# EAGLE board EEZ DIB MCU r2B4 (EAGLE 7.2.0), part 1 of 2
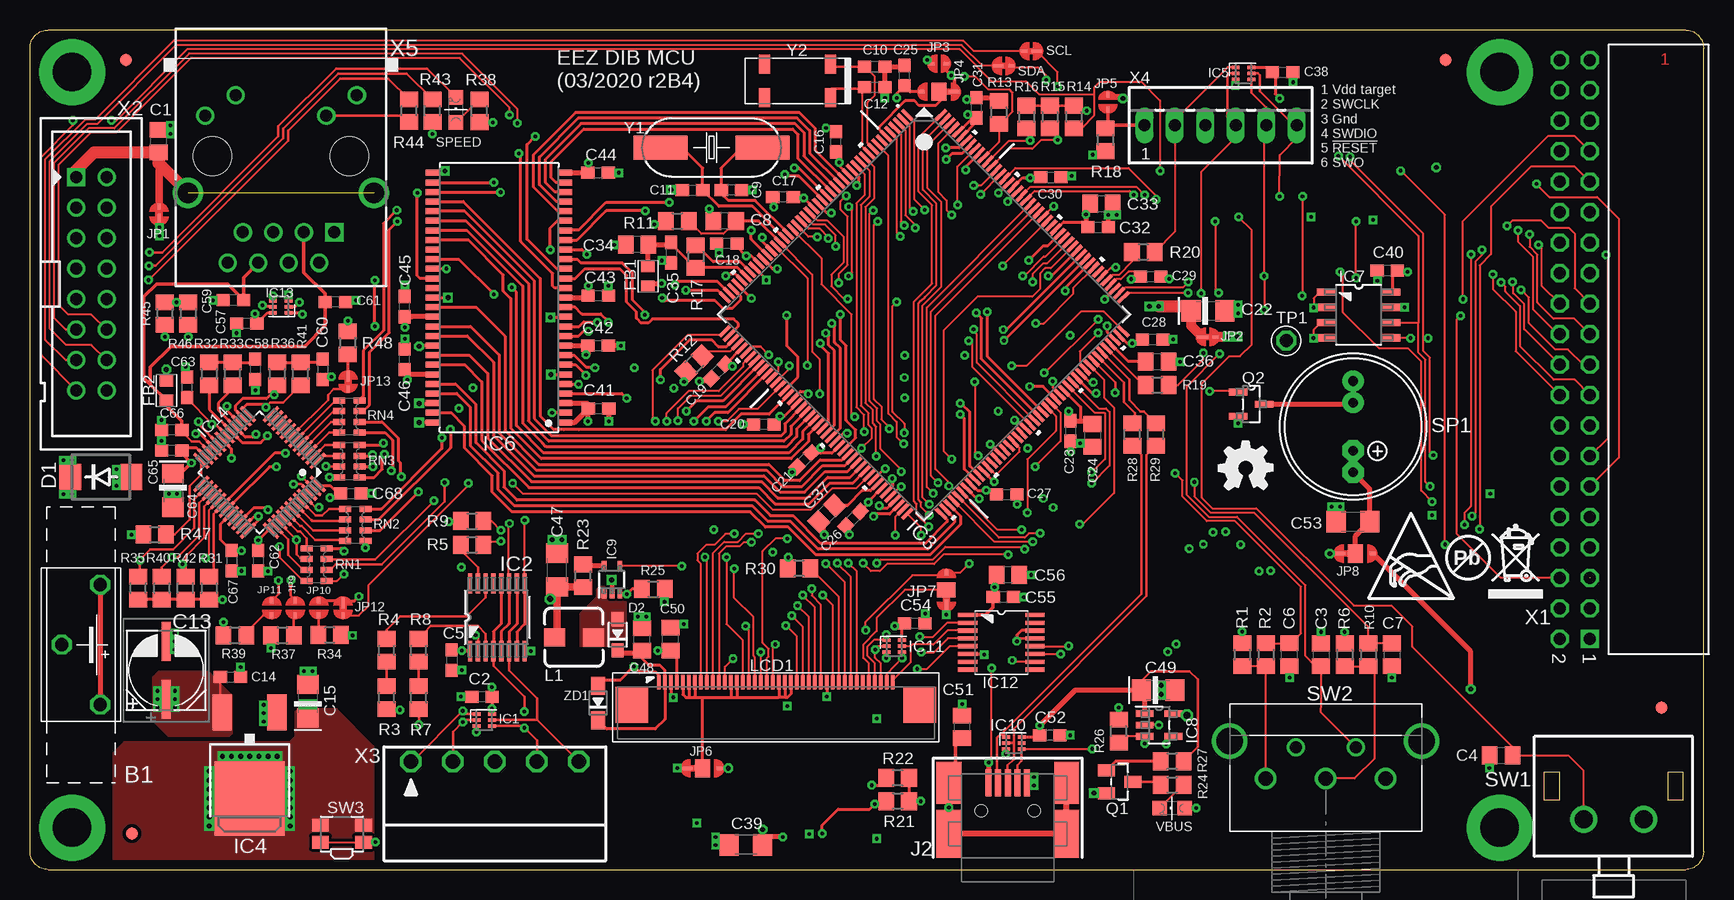
[diagram p5: board, top side]
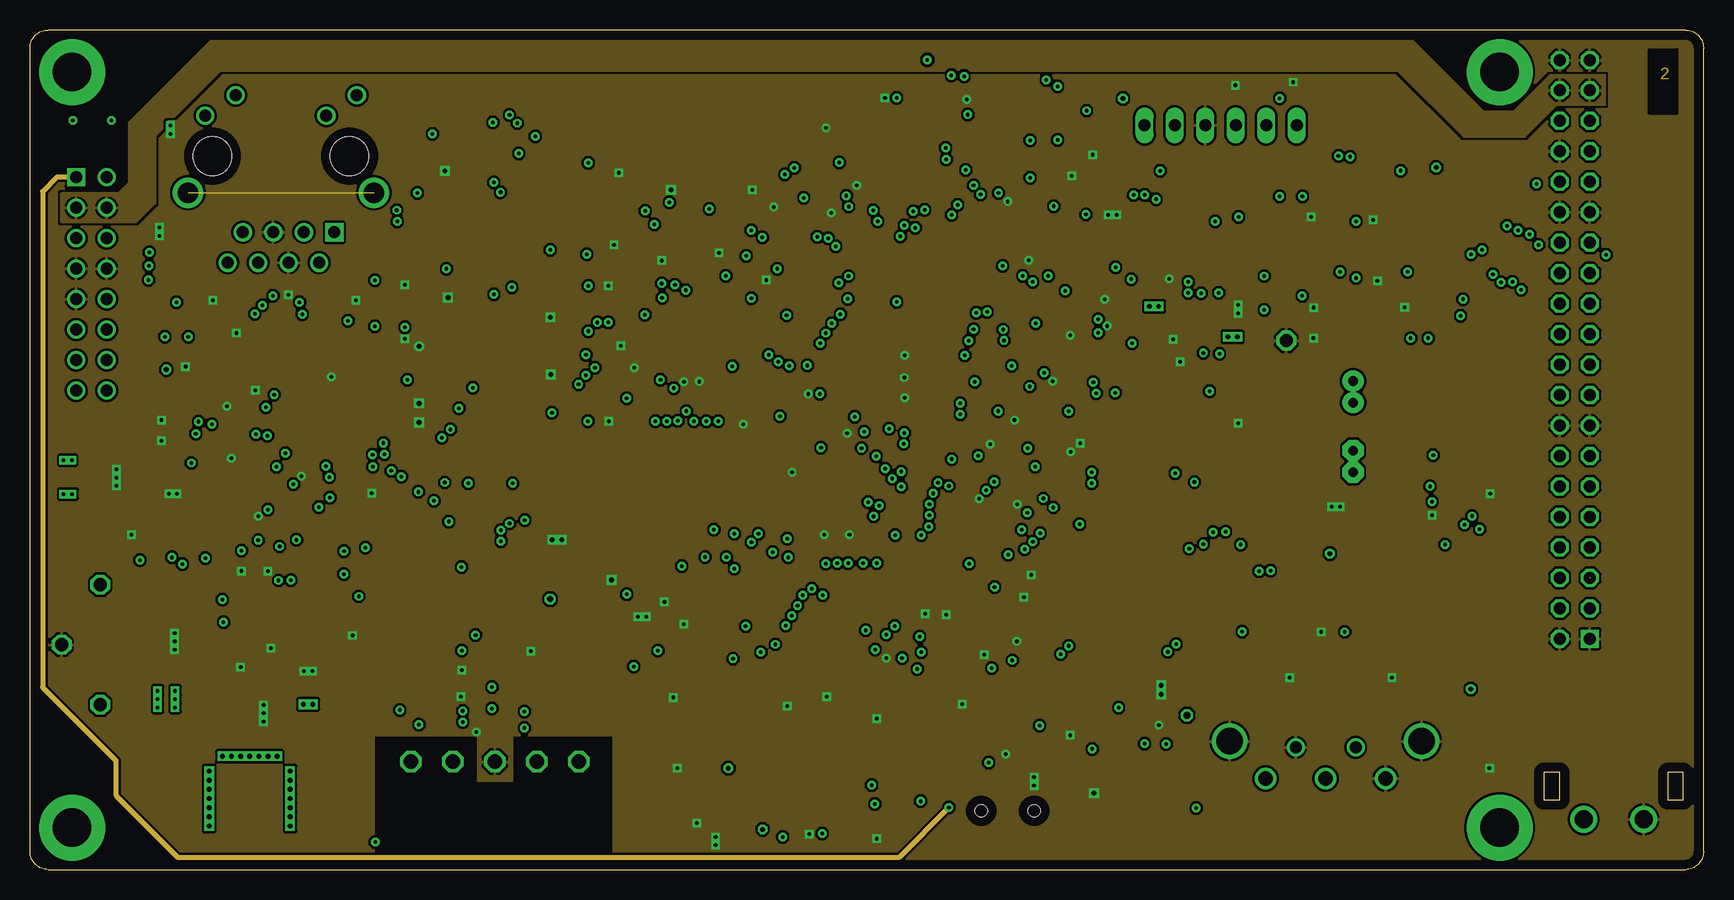
[diagram p6: board, inner layer Gnd]
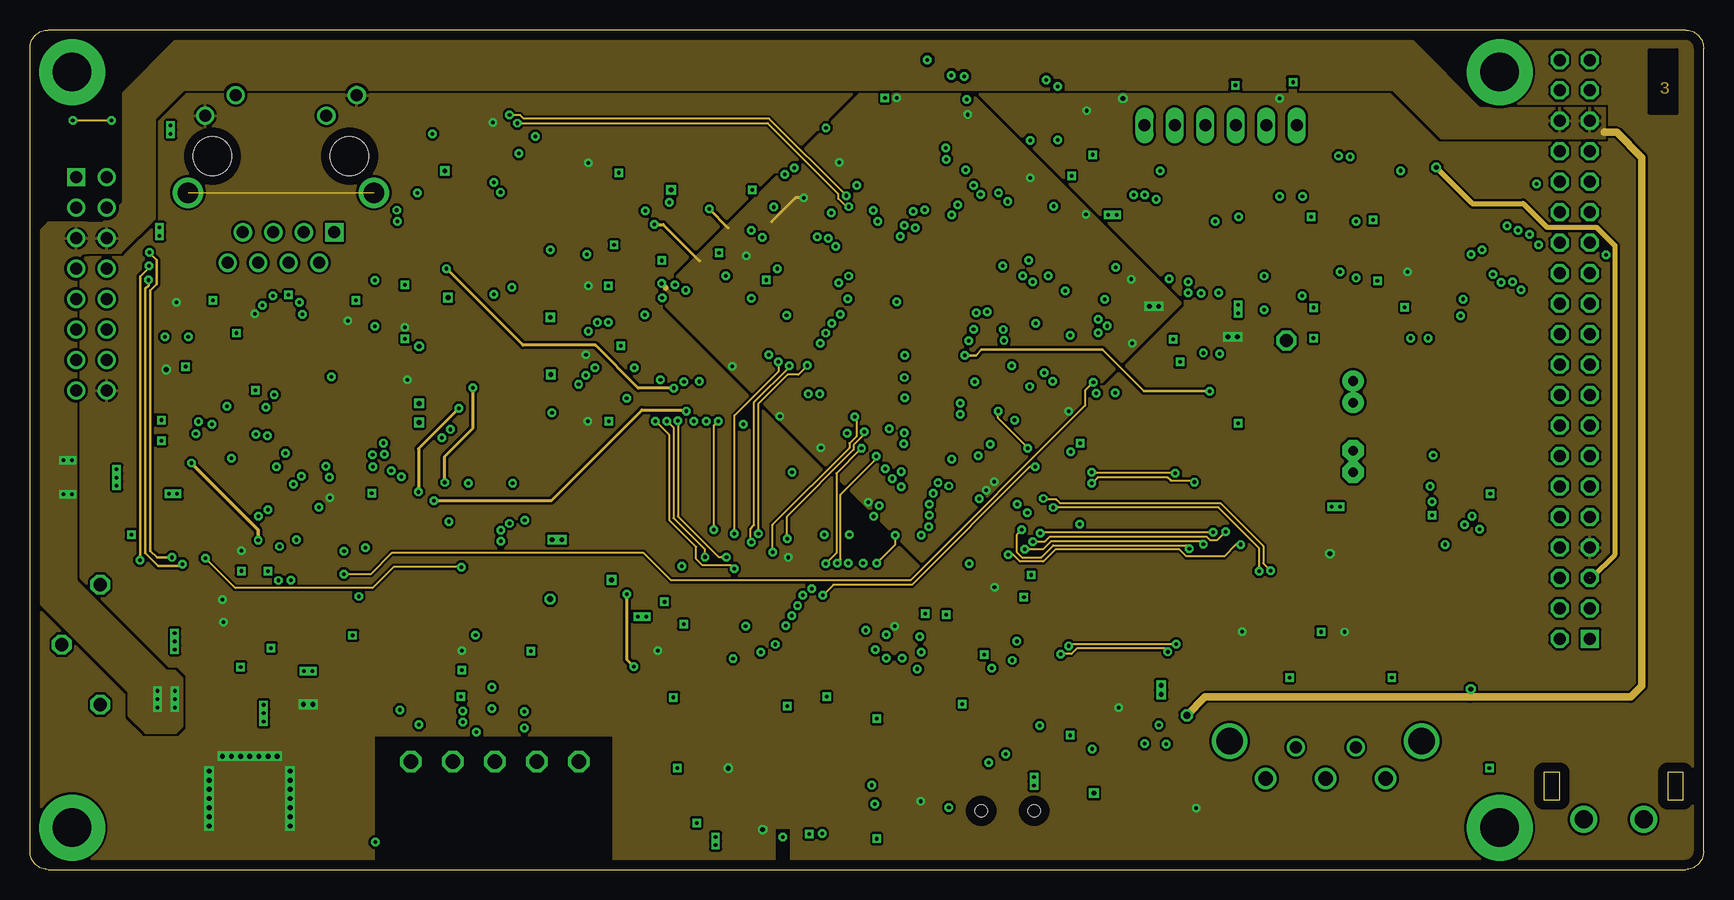
[diagram p7: board, inner layer Power]
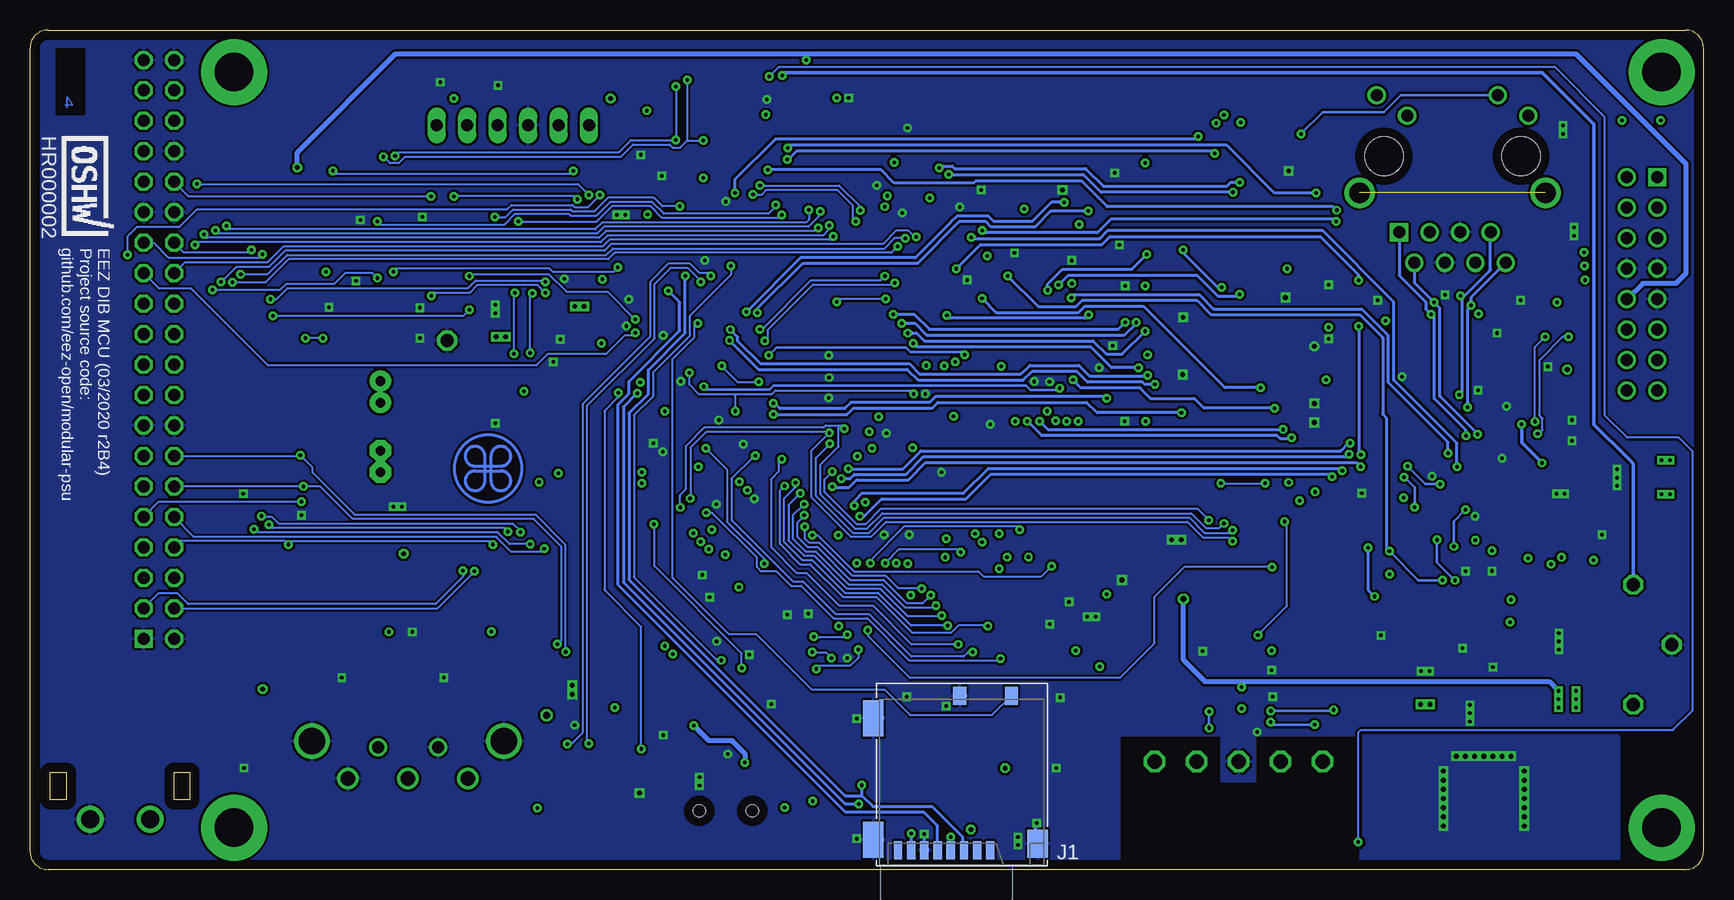
[diagram p8: board, bottom side, seen from below]

Size 139.5 x 70 mm. Coordinates in mm from the lower left corner, seen from the top.
Outline: 1.5,0 138,0 arc90 139.5,1.5 139.5,68.5 arc90 138,70 1.5,70 arc90 0,68.5 0,1.5 arc90 1.5,0
Copper layers (1+2+15+16): Top 0.035559375mm / dielectric 7mil / Gnd 0.03048125mm / dielectric 44mil / Power 0.03048125mm / dielectric 7mil / Bottom 0.035559375mm
Design rules "DIB 4-layer": minimum track width 6mil, minimum drill 0.3mm, track to track 4mil, track to pad 4mil, pad to pad 4mil, via to via 4mil, smd to smd 4mil, copper to edge 30mil, drill to drill 8mil, minimum pad ring 4mil, minimum via ring 8mil, stop-mask expansion 2.5mil, vias tented up to drill 0.6mm, thermal gap 8mil
Net classes: 0 default: width 0.152 mm, drill 0.3 mm, clearance 0.203 mm; 1 diff: width 0.229 mm, drill 0.3 mm, clearance 0.203 mm; 2 gnd: width 0.152 mm, drill 0.3 mm, clearance 0.203 mm

## Footprints (pad centres in the part's own frame; a part is rotated, then mirrored left to right if it is on the bottom)
S8401-46 = drill 1.1 octagon: 1 -5,-1.6; 2 0,1.6; 3 5,-1.6
C0805 = smd 1.3 x 1.5: 1 -0.95,0; 2 0.95,0
C0603 = smd 1.1 x 1: 1 -0.85,0; 2 0.85,0
CAPAE660X610N = smd 3.251 x 0.762: 1 -2.413,0; 2 2.413,0
EC1206 = smd 1.6 x 1.8: + -1.4,0; - 1.4,0
C1206 = smd 1.6 x 1.8: 1 -1.4,0; 2 1.4,0
DO214AA = smd 1.8 x 2.2: A 2.55,0; C -2.55,0
SOD323-R = smd 1.2 x 1: A 1.3,0; C -1.3,0
BEAD0603 = smd 1 x 1.1: P$1 -0.85,0; P$2 0.85,0
FIDUCIAL = smd 1.016 x 1.016: T 0,0
DRL6 = smd 0.654 x 0.301: 1 -0.65,0.5; 2 -0.65,0; 3 -0.65,-0.5; 4 0.65,-0.5; 5 0.65,0; 6 0.65,0.5
PW16 = smd 1.676 x 0.356: 1 -2.819,2.275; 2 -2.819,1.625; 3 -2.819,0.975; 4 -2.819,0.325; 5 -2.819,-0.325; 6 -2.819,-0.975; 7 -2.819,-1.625; 8 -2.819,-2.275; 9 2.819,-2.275; 10 2.819,-1.625; 11 2.819,-0.975; 12 2.819,-0.325; 13 2.819,0.325; 14 2.819,0.975; 15 2.819,1.625; 16 2.819,2.275
LQFP-176_24X24MM = smd 1.2 x 0.3: 1 -12.75,10.75; 2 -12.75,10.25; 3 -12.75,9.75; 4 -12.75,9.25; 5 -12.75,8.75; 6 -12.75,8.25; 7 -12.75,7.75; 8 -12.75,7.25; 9 -12.75,6.75; 10 -12.75,6.25; 11 -12.75,5.75; 12 -12.75,5.25; 13 -12.75,4.75; 14 -12.75,4.25; 15 -12.75,3.75; 16 -12.75,3.25; 17 -12.75,2.75; 18 -12.75,2.25; 19 -12.75,1.75; 20 -12.75,1.25; 21 -12.75,0.75; 22 -12.75,0.25; 23 -12.75,-0.25; 24 -12.75,-0.75; 25 -12.75,-1.25; 26 -12.75,-1.75; 27 -12.75,-2.25; 28 -12.75,-2.75; 29 -12.75,-3.25; 30 -12.75,-3.75; 31 -12.75,-4.25; 32 -12.75,-4.75; 33 -12.75,-5.25; 34 -12.75,-5.75; 35 -12.75,-6.25; 36 -12.75,-6.75; 37 -12.75,-7.25; 38 -12.75,-7.75; 39 -12.75,-8.25; 40 -12.75,-8.75; 41 -12.75,-9.25; 42 -12.75,-9.75; 43 -12.75,-10.25; 44 -12.75,-10.75; 89 12.75,-10.75; 90 12.75,-10.25; 91 12.75,-9.75; 92 12.75,-9.25; 93 12.75,-8.75; 94 12.75,-8.25; 95 12.75,-7.75; 96 12.75,-7.25; 97 12.75,-6.75; 98 12.75,-6.25; 99 12.75,-5.75; 100 12.75,-5.25; 101 12.75,-4.75; 102 12.75,-4.25; 103 12.75,-3.75; 104 12.75,-3.25; 105 12.75,-2.75; 106 12.75,-2.25; 107 12.75,-1.75; 108 12.75,-1.25; 109 12.75,-0.75; 110 12.75,-0.25; 111 12.75,0.25; 112 12.75,0.75; 113 12.75,1.25; 114 12.75,1.75; 115 12.75,2.25; 116 12.75,2.75; 117 12.75,3.25; 118 12.75,3.75; 119 12.75,4.25; 120 12.75,4.75; 121 12.75,5.25; 122 12.75,5.75; 123 12.75,6.25; 124 12.75,6.75; 125 12.75,7.25; 126 12.75,7.75; 127 12.75,8.25; 128 12.75,8.75; 129 12.75,9.25; 130 12.75,9.75; 131 12.75,10.25; 132 12.75,10.75 | smd 0.3 x 1.2: 45 -10.75,-12.75; 46 -10.25,-12.75; 47 -9.75,-12.75; 48 -9.25,-12.75; 49 -8.75,-12.75; 50 -8.25,-12.75; 51 -7.75,-12.75; 52 -7.25,-12.75; 53 -6.75,-12.75; 54 -6.25,-12.75; 55 -5.75,-12.75; 56 -5.25,-12.75; 57 -4.75,-12.75; 58 -4.25,-12.75; 59 -3.75,-12.75; 60 -3.25,-12.75; 61 -2.75,-12.75; 62 -2.25,-12.75; 63 -1.75,-12.75; 64 -1.25,-12.75; 65 -0.75,-12.75; 66 -0.25,-12.75; 67 0.25,-12.75; 68 0.75,-12.75; 69 1.25,-12.75; 70 1.75,-12.75; 71 2.25,-12.75; 72 2.75,-12.75; 73 3.25,-12.75; 74 3.75,-12.75; 75 4.25,-12.75; 76 4.75,-12.75; 77 5.25,-12.75; 78 5.75,-12.75; 79 6.25,-12.75; 80 6.75,-12.75; 81 7.25,-12.75; 82 7.75,-12.75; 83 8.25,-12.75; 84 8.75,-12.75; 85 9.25,-12.75; 86 9.75,-12.75; 87 10.25,-12.75; 88 10.75,-12.75; 133 10.75,12.75; 134 10.25,12.75; 135 9.75,12.75; 136 9.25,12.75; 137 8.75,12.75; 138 8.25,12.75; 139 7.75,12.75; 140 7.25,12.75; 141 6.75,12.75; 142 6.25,12.75; 143 5.75,12.75; 144 5.25,12.75; 145 4.75,12.75; 146 4.25,12.75; 147 3.75,12.75; 148 3.25,12.75; 149 2.75,12.75; 150 2.25,12.75; 151 1.75,12.75; 152 1.25,12.75; 153 0.75,12.75; 154 0.25,12.75; 155 -0.25,12.75; 156 -0.75,12.75; 157 -1.25,12.75; 158 -1.75,12.75; 159 -2.25,12.75; 160 -2.75,12.75; 161 -3.25,12.75; 162 -3.75,12.75; 163 -4.25,12.75; 164 -4.75,12.75; 165 -5.25,12.75; 166 -5.75,12.75; 167 -6.25,12.75; 168 -6.75,12.75; 169 -7.25,12.75; 170 -7.75,12.75; 171 -8.25,12.75; 172 -8.75,12.75; 173 -9.25,12.75; 174 -9.75,12.75; 175 -10.25,12.75; 176 -10.75,12.75
DPACK = smd 1.6 x 3: 1 -2.28,-4.8; 3 2.28,-4.8 | smd 5.8 x 6.2: 4 0,2.38
TSOPII-54 = smd 1.2 x 0.5: 1 -5.502,10.4; 2 -5.502,9.6; 3 -5.502,8.8; 4 -5.502,8; 5 -5.502,7.2; 6 -5.502,6.4; 7 -5.502,5.6; 8 -5.502,4.8; 9 -5.502,4; 10 -5.502,3.2; 11 -5.502,2.4; 12 -5.502,1.6; 13 -5.502,0.8; 14 -5.502,0; 15 -5.502,-0.8; 16 -5.502,-1.6; 17 -5.502,-2.4; 18 -5.502,-3.2; 19 -5.502,-4; 20 -5.502,-4.8; 21 -5.502,-5.6; 22 -5.502,-6.4; 23 -5.502,-7.2; 24 -5.502,-8; 25 -5.502,-8.8; 26 -5.502,-9.6; 27 -5.502,-10.4; 28 5.502,-10.4; 29 5.502,-9.6; 30 5.502,-8.8; 31 5.502,-8; 32 5.502,-7.2; 33 5.502,-6.4; 34 5.502,-5.6; 35 5.502,-4.8; 36 5.502,-4; 37 5.502,-3.2; 38 5.502,-2.4; 39 5.502,-1.6; 40 5.502,-0.8; 41 5.502,0; 42 5.502,0.8; 43 5.502,1.6; 44 5.502,2.4; 45 5.502,3.2; 46 5.502,4; 47 5.502,4.8; 48 5.502,5.6; 49 5.502,6.4; 50 5.502,7.2; 51 5.502,8; 52 5.502,8.8; 53 5.502,9.6; 54 5.502,10.4
SOIC127P600X173-8N = smd 1.55 x 0.6: 1 -2.7,1.9; 2 -2.7,0.63; 3 -2.7,-0.64; 4 -2.7,-1.91; 5 2.7,-1.91; 6 2.7,-0.64; 7 2.7,0.63; 8 2.7,1.9
DBV5 = smd 1.473 x 0.559: 1 -1.194,0.95; 2 -1.194,0; 3 -1.194,-0.95; 4 1.194,-0.95; 5 1.194,0.95
DCK5 = smd 0.85 x 0.4: 1 -1.125,0.65; 2 -1.125,0; 3 -1.125,-0.65; 4 1.125,-0.65; 5 1.125,0.65
PW(R-PDSO-G16) = smd 1.6 x 0.35: 1 -2.8,2.3; 2 -2.8,1.65; 3 -2.8,1; 4 -2.8,0.35; 5 -2.8,-0.3; 6 -2.8,-0.95; 7 -2.8,-1.6; 8 -2.8,-2.25; 9 2.8,-2.25; 10 2.8,-1.6; 11 2.8,-0.95; 12 2.8,-0.3; 13 2.8,0.35; 14 2.8,1; 15 2.8,1.65; 16 2.8,2.3
PT48 = smd 1.676 x 0.279: 1 -4.115,2.75; 2 -4.115,2.25; 3 -4.115,1.75; 4 -4.115,1.25; 5 -4.115,0.75; 6 -4.115,0.25; 7 -4.115,-0.25; 8 -4.115,-0.75; 9 -4.115,-1.25; 10 -4.115,-1.75; 11 -4.115,-2.25; 12 -4.115,-2.75; 25 4.115,-2.75; 26 4.115,-2.25; 27 4.115,-1.75; 28 4.115,-1.25; 29 4.115,-0.75; 30 4.115,-0.25; 31 4.115,0.25; 32 4.115,0.75; 33 4.115,1.25; 34 4.115,1.75; 35 4.115,2.25; 36 4.115,2.75 | smd 0.279 x 1.676: 13 -2.75,-4.115; 14 -2.25,-4.115; 15 -1.75,-4.115; 16 -1.25,-4.115; 17 -0.75,-4.115; 18 -0.25,-4.115; 19 0.25,-4.115; 20 0.75,-4.115; 21 1.25,-4.115; 22 1.75,-4.115; 23 2.25,-4.115; 24 2.75,-4.115; 37 2.75,4.115; 38 2.25,4.115; 39 1.75,4.115; 40 1.25,4.115; 41 0.75,4.115; 42 0.25,4.115; 43 -0.25,4.115; 44 -0.75,4.115; 45 -1.25,4.115; 46 -1.75,4.115; 47 -2.25,4.115; 48 -2.75,4.115
5033981892 = smd 0.7 x 1.5: 1 4.45,12.6; 2 5.55,12.6; 3 6.65,12.6; 4 7.75,12.6; 5 8.85,12.6; 6 9.95,12.6; 7 11.05,12.6; 8 12.15,12.6 | smd 1.7 x 2.33: S 0.5,12.04 | smd 1.7 x 3: S1 14.2,11.7; S2 14.2,1.6 | smd 1.1 x 1.5: SW1 2.7,-0.3; SW2 7,-0.3
678038020 = smd 2.25 x 0.5: 1 6.225,1.6; 2 6.225,0.8; 3 6.225,0; 4 6.225,-0.8; 5 6.225,-1.6 | smd 4 x 2.05: SH1 2,-4.9; SH2 2,4.9 | smd 3.5 x 2.05: SH1.1 6.25,-4.9; SH2.2 6.25,4.9 | hole 1: 3.9,2.2; 3.9,-2.2
JP2-NOCUT = smd 0.889 x 0.254: 1 -0.445,0 | smd 0.508 x 0.254: 2 0.635,0
JP2-CUT = smd 0.508 x 0.254: 1 -0.635,0; 2 0.635,0
JP3-CUT = smd 1.27 x 1.524: COM 0,0 | smd 0.889 x 0.254: NC -1.27,0 | smd 0.508 x 0.254: NO 1.46,0
DE0403 = smd 1.5 x 1.75: 1 0,1.626; 2 0,-1.625
FPC_40 = smd 0.3 x 1.2: 1 -9.75,1.9; 2 -9.25,1.9; 3 -8.75,1.9; 4 -8.25,1.9; 5 -7.75,1.9; 6 -7.25,1.9; 7 -6.75,1.9; 8 -6.25,1.9; 9 -5.75,1.9; 10 -5.25,1.9; 11 -4.75,1.9; 12 -4.25,1.9; 13 -3.75,1.9; 14 -3.25,1.9; 15 -2.75,1.9; 16 -2.25,1.9; 17 -1.75,1.9; 18 -1.25,1.9; 19 -0.75,1.9; 20 -0.25,1.9; 21 0.25,1.9; 22 0.75,1.9; 23 1.25,1.9; 24 1.75,1.9; 25 2.25,1.9; 26 2.75,1.9; 27 3.25,1.9; 28 3.75,1.9; 29 4.25,1.9; 30 4.75,1.9; 31 5.25,1.9; 32 5.75,1.9; 33 6.25,1.9; 34 6.75,1.9; 35 7.25,1.9; 36 7.75,1.9; 37 8.25,1.9; 38 8.75,1.9; 39 9.25,1.9; 40 9.75,1.9 | smd 2.7 x 3: Z1 -12,0; Z2 12,0
SOT23-BEC = smd 1 x 1.4: B -0.95,-1.1; C 0,1.1; E 0.95,-1.1
SOT103P240X110-3N = smd 1.524 x 0.559: 1 -1.079,1.016; 2 -1.079,-1.016; 3 1.079,0
R0805 = smd 1.3 x 1.5: 1 -0.95,0; 2 0.95,0
CAY16 = smd 0.5 x 1: 1 -1.35,-0.85; 2 -0.45,-0.85; 3 0.45,-0.85; 4 1.35,-0.85; 5 1.35,0.85; 6 0.45,0.85; 7 -0.45,0.85; 8 -1.35,0.85
AI-1223-TWT_COMBO = drill 0.8 pad 1.778 octagon: +B 3.8,0; +B.1 2,0 | drill 0.8 pad 1.778: -B -3.8,0; -B.1 -2,0
LED_0805 = smd 1.2 x 1.2: A 0,-1.05; C 0,1.05
TL1100C = drill 1.5: 1 0,2.5; 2 0,-2.5
PEC16-2215F = drill 1.2: A 0,-5; B 0,0; C 0,5 | drill 1: D -2.6,-2.5; E -2.6,2.5 | drill 2.2: GND1 -3.1,8; GND2 -3.1,-8
PANASONIC_EVQP = smd 1.4 x 1.05: 1.1 -1.8,0.725; 1.2 1.8,0.725; 2.1 -1.8,-0.725; 2.2 1.8,-0.725
PCB_SHIELD_TAB = drill 1.1 octagon: 1 0,0
ZL263-40DG = drill 1 pad 1.5 square: 1 48.26,2.54 | drill 1 pad 1.5 octagon: 2 48.26,0; 3 45.72,2.54; 4 45.72,0; 5 43.18,2.54; 6 43.18,0; 7 40.64,2.54; 8 40.64,0; 9 38.1,2.54; 10 38.1,0; 11 35.56,2.54; 12 35.56,0; 13 33.02,2.54; 14 33.02,0; 15 30.48,2.54; 16 30.48,0; 17 27.94,2.54; 18 27.94,0; 19 25.4,2.54; 20 25.4,0; 21 22.86,2.54; 22 22.86,0; 23 20.32,2.54; 24 20.32,0; 25 17.78,2.54; 26 17.78,0; 27 15.24,2.54; 28 15.24,0; 29 12.7,2.54; 30 12.7,0; 31 10.16,2.54; 32 10.16,0; 33 7.62,2.54; 34 7.62,0; 35 5.08,2.54; 36 5.08,0; 37 2.54,2.54; 38 2.54,0; 39 0,2.54; 40 0,0
IDC-16PIN = drill 1 pad 1.422 square: 1 -8.89,-1.27 | drill 1 pad 1.422: 2 -8.89,1.27; 3 -6.35,-1.27; 4 -6.35,1.27; 5 -3.81,-1.27; 6 -3.81,1.27; 7 -1.27,-1.27; 8 -1.27,1.27; 9 1.27,-1.27; 10 1.27,1.27; 11 3.81,-1.27; 12 3.81,1.27; 13 6.35,-1.27; 14 6.35,1.27; 15 8.89,-1.27; 16 8.89,1.27
MC1,5/5-G-3,5 = drill 1.2 octagon: 1 -7,0; 2 -3.5,0; 3 0,0; 4 3.5,0; 5 7,0
22-23-2061 = drill 1 long: 1 -6.35,0; 2 -3.81,0; 3 -1.27,0; 4 1.27,0; 5 3.81,0; 6 6.35,0
RJ45-TRAFO-LED = drill 1 pad 1.524 square: 1 -4.445,6.35 | drill 1 pad 1.524: 2 -3.175,8.89; 3 -1.905,6.35; 4 -0.635,8.89; 5 0.635,6.35; 6 1.905,8.89; 7 3.175,6.35; 8 4.445,8.89; 9 -6.325,-5.08; 10 -3.785,-3.38; 11 3.785,-5.08; 12 6.325,-3.38 | drill 1.7 pad 2.54: SH -7.75,3.05; SH2 7.75,3.05 | hole 3.2: -5.715,0; 5.715,0
HC-49/4H = smd 4.5 x 2: 1 -4.25,0; 2 4.25,0
85SMX = smd 0.9 x 1.6: 1 -2.75,-1.4; 4 -2.75,1.4; NC.2 2.75,-1.4; NC.3 2.75,1.4
SOD323-W = smd 1.5 x 1.2: A 1.45,0; C -1.45,0

## Placement (x,y rotation side)
B1  DS1092-02-B6P  [S8401-46]  4.25,18.75 90 top
C1  N.C.  [C0805]  10.73,60.73 90 top
C2  N.C.  [C0603]  37.68,14.4 180 top
C3  10n  [C0805]  107.62,17.91 270 top
C4  10n  [C0805]  122.63,9.51 0 top
C5  100n  [C0603]  35.16,17.46 270 top
C6  10n  [C0805]  104.99,17.92 90 top
C7  10n  [C0805]  113.52,17.91 270 top
C8  N.C.  [C0805]  57.91,54.06 180 top
C9  18p  [C0603]  58.47,56.64 180 top
C10  4p7  [C0603]  70.42,66.95 0 top
C11  18p  [C0603]  55.23,56.64 0 top
C12  4p7  [C0603]  70.42,65.23 0 top
C13  EEEFK1V470P  [CAPAE660X610N]  11.35,16.61 90 top
C14  100n  [C0603]  16.72,16.05 0 top
C15  4u7  [EC1206]  23.17,14.03 90 top
C16  100n  [C0603]  67.2,60.68 90 top
C17  100n  [C0603]  62.77,56.07 180 top
C18  100n  [C0603]  58.09,52.2 180 top
C19  100n  [C0603]  57.36,41.54 225 top
C20  100n  [C0603]  61.16,37.11 180 top
C21  100n  [C0603]  64.55,34.15 225 top
C22  4u7  [EC1206]  98.19,46.58 0 top
C23  100n  [C0603]  86.72,36.56 270 top
C24  1u  [C0805]  88.57,36.2 270 top
C25  N.C.  [C0603]  72.89,66.19 90 top
C26  100n  [C0603]  68.6,29.26 225 top
C27  100n  [C0603]  81.42,31.27 0 top
C28  100n  [C0603]  93.58,44.2 0 top
C29  100n  [C0603]  93.42,49.43 0 top
C30  100n  [C0603]  85.1,57.71 0 top
C31  100n  [C0603]  78.91,63.51 90 top
C32  100n  [C0603]  89.05,53.54 0 top
C33  1u  [C0805]  89.32,55.51 0 top
C34  1u  [C0805]  50.61,52.1 180 top
C35  100n  [C0603]  53.45,51.44 270 top
C36  2u2  [C0805]  93.96,42.35 0 top
C37  2u2  [C0805]  66.42,29.68 225 top
C38  N.C.  [C0603]  104.42,66.48 0 top
C39  4u7  [C1206]  59.67,2.06 180 top
C40  100n  [C0603]  113.14,49.95 0 top
C41  100n  [C0603]  47.39,38.44 0 top
C42  100n  [C0603]  47.35,43.69 0 top
C43  100n  [C0603]  47.37,47.84 0 top
C44  100n  [C0603]  47.35,58.1 0 top
C45  100n  [C0603]  31.24,46.94 90 top
C46  100n  [C0603]  31.24,42.55 90 top
C47  4u7  [C1206]  43.94,24.97 90 top
C48  1u  [C0805]  51.02,19.19 90 top
C49  4u7  [EC1206]  94.04,14.97 0 top
C50  2u2  [C0805]  53.4,19.2 90 top
C51  N.C.  [C0805]  77.71,11.9 90 top
C52  100n  [C0603]  85.01,11.2 180 top
C53  4u7  [C1206]  110.28,29.01 0 top
C54  N.C.  [C0603]  73.76,20.54 180 top
C55  100n  [C0603]  81.14,22.72 180 top
C56  1u  [C0805]  81.52,24.56 180 top
C57  N.C.  [C0603]  18.07,45.53 180 top
C58  100n  [C0603]  18.75,41.71 270 top
C59  100n  [C0603]  16.95,47.5 0 top
C60  100n  [C0603]  24.39,41.71 270 top
C61  100n  [C0603]  25.46,47.31 180 top
C62  100n  [C0603]  19.01,25.74 270 top
C63  100n  [C0603]  13.1,40.21 90 top
C64  10u  [EC1206]  11.92,31.61 270 top
C65  100n  [C0603]  11.82,34.94 180 top
C66  100n  [C0603]  11.82,36.65 180 top
C67  100n  [C0603]  16.8,25.74 270 top
C68  100n  [C0603]  26.74,31.34 0 top
D1  SMBJ5.0A-TR  [DO214AA]  5.9,32.73 0 top
D2  RB751V40T1G  [SOD323-R]  48.99,19.57 90 top
EEZ_SIGNATURE  SIGNATURESMALL  [SIGNATURE_5MM]  101.32,33.44 180 top
FB1  BLM18AG102SH1D  [BEAD0603]  51.51,49.45 90 top
FB2  BLM18AG102SH1D  [BEAD0603]  11.38,39.94 270 top
FM1  FIDUCIAL  [FIDUCIAL]  8,67.5 0 top
FM2  FIDUCIAL  [FIDUCIAL]  118,67.5 0 top
FM3  FIDUCIAL  [FIDUCIAL]  8.5,3 0 top
FM4  FIDUCIAL  [FIDUCIAL]  136,13.5 0 top
IC1  TPD4E001DRLR  [DRL6]  37.87,12.47 0 top
IC2  CD74HC4050PWR  [PW16]  38.96,21.03 90 top
IC3  STM32F769IIT6  [LQFP-176_24X24MM]  74.53,46.29 315 top
IC4  LD1117ADT33TR  [DPACK]  18.31,8.29 180 top
IC5  N.C.  [DRL6]  101.15,66.38 0 top
IC6  IS42S16400J  [TSOPII-54]  39.1,47.69 180 top
IC7  AT24C256C-SSHL-B  [SOIC127P600X173-8N]  110.77,46.24 0 top
IC8  TPS2051BDBVR  [DBV5]  94.12,12.05 0 top
IC9  TPS61169DCKR  [DCK5]  48.51,24.17 90 top
IC10  TPD4E001DRLR  [DRL6]  82.01,10.55 0 top
IC11  N.C.  [DRL6]  72.04,18.63 0 top
IC12  TSC2007IPW  [PW(R-PDSO-G16)]  80.97,18.92 0 top
IC13  N.C.  [DRL6]  20.9,46.93 180 top
IC14  DP83848CVV/NOPB  [PT48]  19.14,33.11 225 top
J1  503398-1892  [5033981892]  55,14.2 180 bottom
J2  67803-8020  [678038020]  81.5,1 90 top
JP1  JP2-NOCUT  [JP2-NOCUT]  10.75,54.65 90 top
JP2  JP2-NOCUT  [JP2-NOCUT]  98.17,44.41 0 top
JP3  JP2-CUT  [JP2-CUT]  75.78,67.2 180 top
JP4  JP3-CUT  [JP3-CUT]  75.78,64.85 180 top
JP5  JP2-CUT  [JP2-CUT]  89.85,63.98 270 top
JP6  JP3-CUT  [JP3-CUT]  56.05,8.45 0 top
JP7  JP3-CUT  [JP3-CUT]  76.39,23.32 90 top
JP8  JP3-CUT  [JP3-CUT]  110.49,26.34 0 top
JP9  JP2-CUT  [JP2-CUT]  22.12,21.82 270 top
JP10  JP2-CUT  [JP2-CUT]  24.08,21.82 270 top
JP11  JP2-CUT  [JP2-CUT]  20.16,21.82 90 top
JP12  JP2-NOCUT  [JP2-NOCUT]  26.09,21.82 270 top
JP13  JP2-NOCUT  [JP2-NOCUT]  26.51,40.68 270 top
L1  DLG-0403-4R7  [DE0403]  45.34,19.37 90 top
LCD1  505110-4091  [FPC_40]  62.18,13.72 0 top
Q1  N.C.  [SOT23-BEC]  90.83,7.32 270 top
Q2  2N7002  [SOT103P240X110-3N]  101.8,38.8 0 top
R1  4K7  [R0805]  101.05,17.92 270 top
R2  10K  [R0805]  103.02,17.92 270 top
R3  4K7  [R0805]  29.74,14.34 90 top
R4  4K7  [R0805]  29.74,18.28 90 top
R5  1K  [R0805]  36.85,27.08 0 top
R6  4K7  [R0805]  109.58,17.91 270 top
R7  4K7  [R0805]  32.41,14.34 90 top
R8  4K7  [R0805]  32.41,18.28 90 top
R9  1K  [R0805]  36.85,29.04 0 top
R10  10K  [R0805]  111.55,17.91 270 top
R11  4K7  [R0805]  53.96,54.06 0 top
R12  10K  [R0805]  55.37,42.15 45 top
R13  10K  [R0805]  80.76,63.12 270 top
R14  4K7  [R0805]  87,62.74 270 top
R15  2K2  [R0805]  85.02,62.74 270 top
R16  2K2  [R0805]  83.05,62.74 270 top
R17  47R  [R0805]  55.5,51.1 270 top
R18  N.C.  [R0805]  89.66,60.85 90 top
R19  N.C.  [R0805]  93.96,40.39 0 top
R20  N.C.  [R0805]  92.81,51.5 0 top
R21  47K  [R0805]  72.32,5.69 180 top
R22  47K  [R0805]  72.32,7.65 180 top
R23  10R  [R0805]  46.11,24.49 90 top
R24  N.C.  [R0805]  95.21,7.06 0 top
R25  10R  [R0805]  51.95,23.38 0 top
R26  N.C.  [R0805]  90.75,11.54 90 top
R27  N.C.  [R0805]  95.21,9.03 180 top
R28  22R  [R0805]  91.88,36.27 90 top
R29  22R  [R0805]  93.84,36.27 90 top
R30  10K  [R0805]  64.11,25.11 180 top
R31  1K5  [R0805]  14.93,23.46 270 top
R32  49R9  [R0805]  14.94,41.34 270 top
R33  49R9  [R0805]  16.9,41.34 90 top
R34  2K2  [R0805]  24.98,19.55 180 top
R35  2K2  [R0805]  9.03,23.46 90 top
R36  49R9  [R0805]  20.6,41.34 270 top
R37  2K2  [R0805]  21.04,19.53 0 top
R38  N.C.  [R0805]  37.46,63.26 90 top
R39  2K2  [R0805]  17.09,19.53 0 top
R40  2K2  [R0805]  10.99,23.46 90 top
R41  49R9  [R0805]  22.56,41.34 90 top
R42  2K2  [R0805]  12.96,23.46 90 top
R43  220R  [R0805]  33.55,63.27 90 top
R44  220R  [R0805]  31.59,63.27 90 top
R45  2K2  [R0805]  11.22,46.35 270 top
R46  2K2  [R0805]  13.19,46.35 270 top
R47  4K87  [R0805]  10.4,27.93 0 top
R48  2K2  [R0805]  26.48,43.92 270 top
RN1  DR1206-33R-4/8  [CAY16]  23.9,25.43 90 top
RN2  DR1206-33R-4/8  [CAY16]  27.11,28.73 90 top
RN3  DR1206-33R-4/8  [CAY16]  26.64,34.04 90 top
RN4  DR1206-33R-4/8  [CAY16]  26.62,37.77 90 top
SCL  JP2-NOCUT  [JP2-NOCUT]  83.47,68.24 180 top
SDA  JP2-NOCUT  [JP2-NOCUT]  81.16,67.01 0 top
SP1  AI-1223-TWT or LD-BZEN 0903  [AI-1223-TWT_COMBO]  110.3,36.93 270 top
SPEED  N.C.  [LED_0805]  35.51,63.33 0 top
SW1  TL1100CF160Q  [TL1100C]  132,4.2 90 top
SW2  PEC16-2215F-S0024  [PEC16-2215F]  108,7.6 270 top
SW3  EVQP7A01P  [PANASONIC_EVQP]  26,3 180 top
TP1  [PCB_SHIELD_TAB]  104.72,44.09 0 top
U$1  [RECYCLE_BIN1/8]  121.55,22.59 0 top
U$3  HR000002  [CERT-SMALL-SILK]  136.85,57.01 270 bottom
U$5  [PB_SMALL]  119.87,26 180 top
U$6  [ESD_SYMBOL]  111.56,22.61 0 top
VBUS  N.C.  [LED_0805]  95.21,5.12 90 top
X1  DS1024-2*20R0  [ZL263-40DG]  127.5,67.5 270 top
X2  DS1013-16SSIB1  [IDC-16PIN]  5.11,48.82 270 top
X3  691322110005  [MC1,5/5-G-3,5]  38.75,9 0 top
X4  N.C.  [22-23-2061]  99.25,62.05 0 top
X5  LMJTAB881243M-L  [RJ45-TRAFO-LED]  20.92,59.48 180 top
Y1  25MHz  [HC-49/4H]  56.82,60.2 0 top
Y2  XTAL016178-85SMX  [85SMX]  63.99,65.75 180 top
ZD1  BZX384-B24.115  [SOD323-W]  47.35,13.88 90 top

## Tracks (layer width: path | path; a pad name or v marks a point on that pad's centre or on a via)
!FAULT  (via drill 0.3)  (1 unrouted)
  Top 0.152: IC3.58 60.63,38.41 59.1,38.41 58.09,37.39 v57.36,37.39 | R14.2 87.63,61.79 88.72,62.88 88.72,64.64 | v117.95,27.1 117.95,54.59 v114.26,58.27 | v94.22,58.26 94.19,58.28 94.19,64.12 92.63,65.68 89.19,65.68 88.72,65.22 88.72,64.64 | 88.72,64.64 84.11,64.64 83.07,65.68 80.2,65.68 77.5,68.38 13.1,68.38 7.17,62.45 v6.78,62.45 | v81.53,26.25 76.14,26.25 75.36,25.46 71.42,25.46 70.84,24.88 70.09,24.88 v69.44,25.53 | 0.92,42.88 0.92,59.41 3.56,62.05 v3.56,62.45
  Top 0.203: 3.84,39.94 3.84,39.95 0.92,42.88
  Power 0.152: v100.92,27.1 100.53,27.1 99.55,26.12 96.38,26.12 95.83,26.67 85.47,26.67 84.46,25.67 82.53,25.67 81.95,26.25 v81.53,26.25 | v57.01,28.35 57.01,37.03 v57.36,37.39 | v6.78,62.45 v3.56,62.45
  Bottom 0.152: v114.26,58.27 114.26,58.26 114.04,58.04 94.43,58.04 v94.22,58.26 | v100.92,27.1 101.2,27.38 117.67,27.38 v117.95,27.1 118.23,27.38 126.98,27.38 X1.8 | v69.44,25.53 69.44,25.78 66.59,28.63 57.29,28.63 v57.01,28.35
!RESET  (via drill 0.3)
  Top 0.152: IC3.31 65.2,49.62 65.2,43.18 65.85,42.53 v65.85,39.65 | v89.05,45.87 84.6,41.43 v84.54,41.43 | v69.66,19.94 69.66,20.64 73.54,24.52 76.13,24.52 JP7.NO 77.57,24.78 v78.28,25.49 | v102.89,46.66 v102.89,49.48 102.89,61.89 X4.5 | X1.6 122.59,24.32 118.94,27.96 118.94,45.87 v119.25,46.18 | C8.1 57.8,53.01 55.96,53.01 R11.2 | IC14.29 14.91,29.94 14.91,26.26 v14.61,25.97
  Top 0.203: IC5.4 101.8,64.78 103.01,63.58 103.01,62.1 X4.5
  Top 0.254: IC3.31 60.75,54.06 C8.1
  Power 0.152: v83.18,35.14 80.69,37.63 v80.69,38.23 | v35.96,25.22 30.3,25.22 28.55,23.47 17.12,23.47 v14.61,25.97
  Bottom 0.152: v65.85,39.65 66.15,39.95 77.35,39.95 77.68,39.62 80.67,39.62 | v84.54,41.43 84.53,41.41 84.53,40.42 83.73,39.62 80.67,39.62 | v69.66,19.94 69.66,19.48 66.15,15.98 48.65,15.98 45.77,18.86 45.77,22.73 43.28,25.22 v35.96,25.22 | v119.25,46.18 103.37,46.18 v102.89,46.66 | v89.05,45.87 91.35,48.17 94.79,48.17 96.26,49.64 102.74,49.64 v102.89,49.48 | v78.28,25.49 78.28,25.89 81.38,28.99 81.38,33.34 v83.18,35.14 | v80.69,38.23 80.69,39.6 80.67,39.62
!USB_OTG_FS_OC  (via drill 0.3)
  Top 0.152: v83.58,48.98 83.58,49.64 84.48,50.55 84.79,50.55 IC3.146 | v92.91,10.49 IC8.3 91.26,11.1 R26.1
  Bottom 0.152: v83.58,48.98 83.58,49.07 84.65,50.15 86.11,50.15 87.44,48.83 87.44,44.28 93.09,38.63 93.09,10.67 v92.91,10.49
+3V3  (via drill 0.3, 0.4)
  Top 0.152: R1.1 v101.05,19.82 | R6.1 v109.58,19.81 | 72.69,20.41 72.18,20.41 v72.07,20.3 | R30.2 63.16,25.97 v63.2,26.02 | C46.1 31.44,41.7 31.45,41.68 | IC4.4 v14.94,5.92 | v38.59,62.31 R38.1
  Top 0.203: R16.1 R15.1 R14.1 87.42,63.27 v88.08,63.27 | 103.79,66.48 C38.1 | VBUS.A v97.22,5.12 | C67.1 v17.64,26.59 | R45.1 v12.21,47.3 v12.21,47.31 v12.22,47.3 R46.1 | v16.14,20.61 R39.1
  Top 0.254: IC11.6 72.69,20.32 C54.2 72.69,20.32 72.69,20.41 | IC14.32 15.87,28.78 15.87,27.52 C67.1 16.67,26.61 | v31.25,45.21 31.25,46.08 C45.1 | 14.49,22.06 R31.2 | v25,31.01 25.56,31.01 C68.1 25.7,31.34 25.07,31.98 24.15,31.98 IC14.48 | 46.37,47.69 C43.1 | C56.2 80.42,24.09 v80.4,23.55 80.4,22.83 C55.2 | v52.35,18.25 C50.1 53.92,17.73 LCD1.4 | 113.97,49.59 C40.2 113.62,49.62 113.62,48.17 113.63,48.14 IC7.8 | JP6.NO v58.21,8.45 | v22.79,13.77 22.8,12.27 C15.+ | IC5.6 103.17,66.88 C38.1 | 103.79,66.48 103.79,64.68 v104.17,64.3 | R22.1 R21.1 v74.24,5.69 | R31.2 15.21,22.51 | R31.2 R42.1 R40.1 R35.1 | R48.1 26.48,45.73 v26.5,45.76 | IC13.6 19.81,46.43 C57.1 18.92,46.14 v18.74,46.32 | v16.04,22.5 R31.2
  Top 0.305: IC12.1 79.64,21.22 80.29,21.87 C55.2 | C40.2 114.78,49.95 v114.83,49.84 | JP8.NC v108.35,26.34 | FB2.P$1 11.38,41.67 v11.36,41.68 | C5.1 35.94,18.31 v35.99,18.26 36.04,18.21 IC2.1
  Top 0.406: IC6.3 46.48,38.89 C41.1 | v46.53,48.67 46.53,47.71 C43.1 | v46.35,42.93 46.51,42.95 C42.1 IC6.9 | v46.53,58.93 46.51,58.9 C44.1 46.49,58.09 IC6.27 | IC6.43 31.83,46.09 C45.1 | IC6.49 31.66,41.29 C46.1 | 31.45,41.68 v31.45,40.82 | IC6.14 46.37,47.69 | v46.52,37.38 46.52,38.42 C41.1 | IC6.1 45.39,37.29 C41.1 | v90.75,13.49 R26.2 | v91.11,64.29 v91.11,64.3 90.97,64.44 90.03,64.44 JP5.1 | v61.07,3.34 61.07,2.85 | 61.07,2.85 C39.1 | v62.75,2.72 61.2,2.72 61.07,2.85
  Top 0.813: v99.86,44.41 JP2.2
  Bottom 0.406: J1.4 v62.75,2.71 v62.75,2.72
  other vias: 14.94,5.16 14.94,4.39 14.94,6.68 14.94,7.44 14.94,8.2 14.94,3.63 100.64,44.41 23.58,13.77 21.68,3.63 21.68,4.39 21.68,5.16 21.68,5.92 21.68,6.68 21.68,7.44 21.68,8.2 18.32,9.45 17.56,9.45 16.8,9.45 19.08,9.45 19.85,9.45 16.04,9.45 20.61,9.45
  pour Power (isolate 0.203, rank 4): -0.07,69.34 139.62,69.85 139.62,0.76 63.48,0.76 63.48,3.49 62.02,3.49 62.02,0.76 48.69,0.76 48.69,11.18 28.62,11.18 28.62,0.25 -0.07,0.25
  pour Bottom (isolate 0.254, no thermals): 7.41,11.43 28.62,11.43 28.62,0.57 7.03,0.57 7.03,11.05
  pour Top (isolate 0.254, no thermals): 6.97,0.19 6.97,9.72 7.86,10.6 21.64,10.6 22.14,11.11 22.14,13.14 22.34,13.34 25.57,13.34 28.62,10.29 28.62,0.19
+3V3(A)
  Top 0.203: IC14.22 14.1,35.67 13.47,35.67 12.67,36.48 C66.1
  Top 0.254: 12.47,36.66 C66.1 | C61.2
  Top 0.305: C66.1 12.66,36.66 12.66,37.38 11.39,38.65 FB2.P$2 10.03,40.44 | 10.03,40.44 9.48,40.98 9.48,47.75 10.56,48.83 16.47,48.83 C59.2 17.8,49.38 X5.6 | X5.3 22.83,49.79 24.61,48.01 C61.2 24.61,45.34 22.89,43.62 11.76,43.62 10.03,41.9 10.03,40.44
+5V  (via drill 0.3, 0.4, 0.5, 0.6)
  Top 0.203: IC1.6 38.52,13.41 v38.5,13.42 | C2.1 38.52,14.41 v38.52,15.2 | C14.1 15.87,13.25 IC4.3
  Top 0.254: C2.1 38.53,13.42 v38.5,13.42
  Top 0.406: IC8.5 96.34,13 v96.44,12.87 | v10.64,14.2 C13.1 11.26,14.22 11.26,14.55 | 16.05,13.11 IC4.3 | D1.C 3.1,32.66 | v120.1,15.05 120.1,18.19 JP8.NO
  Top 0.61: C47.1 43.94,19.37 L1.1 | R23.1 46.11,23.57 C47.1 | v43.35,22.54 43.35,23.57 C47.1 | 3.1,32.66 3.06,32.7 v3.49,34.12
  Top 1.016: IC4.3 | 3.74,33.11 D1.C
  Top 1.524: IC4.3 16.03,12.36 16,12.33
  Power 0.406: v120.1,15.05 120.1,14.43 120.05,14.38
  Power 0.61: 131.24,61.47 132.25,61.47 134.38,59.35 134.38,15.33 133.42,14.38 120.05,14.38 97.95,14.38 v96.44,12.87 | v2.8,34.12 v3.49,34.12
  Bottom 0.406: v43.35,22.54 43.35,17.46 41.56,15.67 38.52,15.67 | v38.52,15.2 38.52,15.67 | 38.52,15.67 12.87,15.67 v12.1,14.9
  other vias: 10.64,14.9 10.64,13.5 2.8,31.31 3.5,31.31 12.1,14.2 12.1,13.5
  pour Power (isolate 0.254): 3.83,53.91 6.08,53.91 7.79,55.63 7.79,64.77 12.11,69.09 115.24,69.09 120.82,63.5 131.24,63.5 131.24,60.96 117.65,60.96 113.58,65.02 12.81,65.02 10.33,62.55 10.33,54.23 7.54,51.44 3.83,51.44
  pour Power (isolate 0.254): 4.75,53.91 1.51,53.91 0.05,52.45 -0.02,23.05 8.24,14.8 8.24,12.83 9.64,11.43 12.18,11.43 12.68,11.94 12.68,15.94 12.11,16.51 11.41,16.51 3.86,24.07 3.86,50.86 4.43,51.44 4.75,51.44
  pour Top (isolate 0.254, no thermals): 16.77,14.55 16.77,11.35 16.57,11.15 11.55,11.15 10.3,12.41 10.3,16.03 10.74,16.47 14.84,16.47 16.75,14.57
+12V
  pour Gnd (isolate 0.254): 2.65,56.39 7.41,56.39 8.3,57.28 8.3,62.29 15.1,69.09 115.24,69.09 121.14,63.18 123.68,63.18 126.73,66.23 131.24,66.23 131.24,63.75 127.24,63.75 124.57,61.09 119.55,61.09 114.03,66.61 15.86,66.61 10.4,61.15 10.4,55.56 8.81,53.98 2.65,53.98
+VAUX  (via drill 0.3, 0.4)  (1 unrouted)
  Top 0.305: JP3.2 75.07,67.2 v74.8,67.51
  Power 0.406: 130.04,24.34 130.2,24.34 132.14,26.28 132.14,51.99 130.58,53.56 126.45,53.56 124.47,55.54 120.2,55.54 120.2,55.55 v117.22,58.53
  Bottom 0.305: v74.8,67.51 74.79,67.96 74.84,68.01
  Bottom 0.406: v117.22,58.53 117.22,59.79 109,68.01 74.84,68.01 10.64,68.01 1.47,58.84 1.47,49.7 2.31,48.86 5.08,48.86 X2.10
BOOT0  (via drill 0.3)
  Top 0.152: IC3.166 80.75,60.65 R13.2 80.87,62.17 81.9,63.2 81.9,64.78 81.63,65.05 79.87,65.05 78.77,66.14 v77.86,66.14 | v28.79,2.29 28.78,2.27 SW3.1.1 SW3.1.2
  Bottom 0.152: v28.79,2.29 28.79,11.42 28.57,11.63 2.56,11.63 0.91,13.28 0.91,34.84 2.08,36.01 6.36,36.01 8.25,37.9 8.25,62.76 12.37,66.88 77.12,66.88 v77.86,66.14
BYPASS_REG
  Top 0.152: IC3.48 58.35,43.19 56.41,43.19 R12.2
DAC_OUT1  (via drill 0.3)
  Top 0.152: Q2.1 100.66,39.88 v98.33,39.88
  Top 0.203: IC3.50 60.17,43.6 60.89,43.6 v61.58,42.91
  Power 0.203: v77.92,42.86 78.84,42.86 79.32,43.34 89.39,43.34 92.85,39.89 v98.32,39.89 v98.33,39.88
  Bottom 0.203: v61.58,42.91 61.81,43.14 66.09,43.14 66.47,43.52 77.26,43.52 v77.92,42.86
DIN2  (via drill 0.3)
  Top 0.152: IC3.8 71.55,59.53 71.55,38.01 72.25,37.31 72.25,36.07 v72.83,35.48 | v39.24,28.28 38.48,29.05 R9.2
  Bottom 0.152: v72.83,35.48 73.99,34.33 73.99,31.17 70.9,28.08 69.57,28.08 68.3,29.35 42.87,29.35 41.59,28.07 39.45,28.07 v39.24,28.28
DOUT2  (via drill 0.3)
  Top 0.152: IC3.163 79.27,57.04 v78.65,57.04 | v70.29,54.97 70,54.67 70,39.06 70.61,38.46 70.61,37.38 70.89,37.1 70.89,35.06 72.61,33.34 v72.61,33.19 | IC2.9 v41.23,29.13
  Top 0.254: IC2.9 41.23,20.46 40.59,19.81 IC2.7 | IC2.7
  Bottom 0.152: v72.61,33.19 73.28,32.52 73.28,31.48 70.58,28.79 69.87,28.79 68.58,30.09 42.19,30.09 v41.23,29.13 | v78.65,57.04 72.06,57.04 70.29,55.27 v70.29,54.97
ENC_A  (via drill 0.3)
  Top 0.152: R2.1 C6.2 105.11,18.87 105.94,19.7 105.94,23.57 100.45,29.06 98.1,29.06 96.07,31.09 96.07,32.45 v95.46,33.06 | IC3.119 88.75,38.09 89.54,38.09 89.61,38.02 89.61,34.23 v88.52,33.13
  Power 0.152: v95.46,33.06 88.62,33.06 v88.52,33.13
ENC_B  (via drill 0.3)
  Top 0.152: C7.1 R10.1 111.55,20.24 102.03,29.77 98.41,29.77 97.06,31.11 v97.06,32.31 | IC3.120 89.1,38.44 89.7,38.44 89.99,38.15 89.99,33.68 v88.52,32.21
  Power 0.152: v97.06,32.31 96.95,32.42 95.09,32.42 94.81,32.7 89.01,32.7 v88.52,32.21
ENC_SW  (via drill 0.3)
  Top 0.152: IC3.173 75.69,60.53 75.69,56.5 76.41,55.78 76.41,54.99 v76.82,54.59 | v98.8,54.03 98.8,48.39 v99.09,48.09 | v99.16,43.02 96.43,40.28 96.43,31.24 98.26,29.41 100.61,29.41 106.32,23.7 106.32,17.79 107.16,16.96 C3.2 107.62,13.64 107.62,13.48 107.62,13.08 SW2.E
  Bottom 0.152: v99.16,43.02 99.16,48.03 v99.09,48.09 | v98.8,54.03 92.27,54.03 90.99,55.31 87.79,55.31 86.8,54.32 77.08,54.32 v76.82,54.59
EOUT_A
  Top 0.152: R6.2 R10.2 112.1,16.41 112.1,9.28 110.42,7.6 SW2.B
EOUT_B
  Top 0.152: R1.2 R2.2 103,16.95 SW2.A
ETH_COL  (via drill 0.3)
  Top 0.254: v52.56,40.84 52.56,41.69 55.04,44.17 56.82,44.17 57.36,43.62 58.08,43.62 IC3.47 | RN2.2 29.18,28.28 v32.38,31.48
  Power 0.254: v35.76,38.47 32.38,35.09 v32.38,31.48
  Bottom 0.254: v35.76,38.47 41.64,38.47 42.45,39.28 46.1,39.28 46.97,40.16 51.88,40.16 v52.56,40.84
ETH_CRS  (via drill 0.3)
  Top 0.203: v21.74,24.12 21.74,22.84 JP9.1
  Top 0.254: IC3.40 58.82,49.63 58.15,49.63 v58.01,49.49 | RN1.4 25.91,26.77 v26.18,26.54
  Bottom 0.203: v26.18,26.54 23.76,24.12 v21.74,24.12
  Bottom 0.254: v58.01,49.49 55.46,46.94 52.3,46.94 51.77,47.46 42.25,47.46 41.05,46.27 28.66,46.27 26.74,44.35 26.74,37.96 26.4,37.62 26.4,26.76 v26.18,26.54
ETH_MDC  (via drill 0.3)
  Top 0.203: IC14.31 16.88,30.5
  Top 0.254: v20.56,33.58 19.96,33.58 16.88,30.5 | IC3.33 61.05,52.35 v61.05,52.69
  Bottom 0.254: v61.05,52.69 60.96,52.6 50.33,52.62 49.68,53.26 31.75,53.25 25.82,47.32 25.82,40.8 20.56,35.55 v20.56,33.58
ETH_MDIO  (via drill 0.3)
  Top 0.203: IC14.30 15.32,29.65 15.32,24.8 R31.1
  Top 0.254: IC3.42 59.22,47.82 59.22,47.47 58.56,46.81 57.72,46.81 57.11,47.42 52.92,47.42 v52.69,47.65 | v21.29,34.72 20.39,34.72 IC14.30
  Bottom 0.254: v52.69,47.65 52.4,47.94 42.03,47.94 40.84,46.75 28.5,46.75 26.27,44.53 26.27,40.62 21.29,35.64 v21.29,34.72
ETH_RX_CLK  (via drill 0.3)
  Top 0.203: 24.8,25.13 25.17,25.13 25.5,25.45 29.33,25.45 34.57,30.68 v34.57,32.27
  Top 0.254: IC3.41 60.1,47.64 v60.14,47.64 | 24.8,25.13 RN1.2
  Power 0.254: v36.9,40.18 36.9,36.78 34.57,34.44 v34.57,32.27
  Bottom 0.254: v60.14,47.64 58.96,46.46 52.09,46.46 51.57,46.98 46.71,46.98 39.91,40.18 v36.9,40.18
ETH_RX_DV  (via drill 0.3)
  Top 0.203: 24.87,25.86 28.79,25.86 v33.68,30.75
  Top 0.254: IC3.53 57.76,39.06 55.57,39.06 v54.72,38.23 | 24.87,25.86 RN1.3
  Power 0.254: v54.72,38.23 54.63,38.32 51.01,38.32 43.44,30.75 v33.68,30.75
ETH_RX_ER  (via drill 0.3)
  Top 0.203: v27.96,26.84 RN2.1
  Top 0.254: JP12.1 26.09,22.35 26.13,22.39 | 26.13,22.39 24.14,22.39 JP10.1 | 26.13,22.39 27.02,22.39 v27.4,22.77
  Bottom 0.254: v27.96,26.84 27.96,23.33 v27.4,22.77
ETH_RX_ERR  (via drill 0.3)
  Top 0.152: IC3.79 68.87,31.79 66.86,31.79 65.07,30 61.93,30 60.6,31.33 41.11,31.33 v40.23,32.21 | v36.53,32.21 36.53,32.02 28.23,23.71 28.23,22 27.42,21.18 JP12.2
  Bottom 0.152: v40.23,32.21 v36.53,32.21
ETH_RXD0  (via drill 0.3)
  Top 0.254: v35.05,36.69 35.05,35.15 29.07,29.18 RN2.3 | IC3.54 57.98,38.58 56.54,38.58 v55.34,37.39
  Bottom 0.254: v35.05,36.69 35.07,36.66 54.62,36.66 v55.34,37.39
ETH_RXD1  (via drill 0.3)
  Top 0.254: IC3.55 61.42,41.34 58.17,38.1 57.07,38.1 v56.36,37.39 | 27.82,30.04 RN2.4 29.31,30.08 34.32,35.09 v34.32,36.01
  Bottom 0.254: v56.36,37.39 55.15,36.18 35.54,36.18 35.3,35.94 34.39,35.94 v34.32,36.01
ETH_RXD2  (via drill 0.3)
  Top 0.254: IC3.83 71.93,32.02 71.93,32.54 v71.86,32.6 | RN3.1 28.67,32.69 29.37,33.39 29.37,34.45 v29.54,34.62
  Bottom 0.254: v71.86,32.6 71.14,32.6 70.79,32.96 66.48,32.96 65.02,34.42 29.74,34.42 v29.54,34.62
ETH_RXD3  (via drill 0.3)
  Top 0.254: IC3.84 72.53,31.91 v72.64,31.91 | RN3.2 v28.57,33.59
  Bottom 0.152: v72.64,31.91 72.59,31.86
  Bottom 0.254: 72.59,31.86 71.22,31.86 70.6,32.49 66.29,32.49 64.84,33.93 28.91,33.93 v28.57,33.59
ETH_TX_CLK  (via drill 0.3)
  Top 0.254: IC3.35 61.88,50.1 v62.29,50.1 | v28.75,45.29 28.75,49.12 v28.74,49.14 | RN3.3 28.46,34.49 v28.56,34.58
  Bottom 0.254: v62.29,50.1 60.27,52.12 50.14,52.12 49.48,52.78 31.95,52.77 28.74,49.55 v28.74,49.14 | v28.75,45.29 28.75,34.77 v28.56,34.58
ETH_TX_EN  (via drill 0.3)
  Top 0.254: v71.29,33.41 71.2,33.41 IC3.80 | RN3.4 29.3,35.39 v29.47,35.56
  Bottom 0.254: v71.29,33.41 66.72,33.41 65.24,34.9 30.25,34.9 29.59,35.56 v29.47,35.56
ETH_TXD0  (via drill 0.3)
  Top 0.254: IC3.85 71.45,30.12 70.99,30.12 v70.79,30.33 | RN4.1 29.6,36.42 30.22,35.8 30.22,33.36 v30.11,33.25
  Bottom 0.254: v70.79,30.33 70.79,30.72 70.13,31.38 61.67,31.38 59.6,33.45 30.31,33.45 v30.11,33.25
ETH_TXD1  (via drill 0.3)
  Top 0.254: IC3.86 71.66,29.63 70.51,29.63 v70.32,29.44 | RN4.2 29.35,37.32 30.69,35.98 30.69,34.1 30.87,33.92 30.87,32.85 v30.97,32.75
  Bottom 0.254: v70.32,29.44 69.97,29.44 68.51,30.9 61.46,30.9 59.39,32.97 31.19,32.97 v30.97,32.75
ETH_TXD2  (via drill 0.3)
  Top 0.254: IC3.34 60.12,52.57 v60.12,53.3 | RN4.3 27.78,38.22 28.3,38.75 28.3,43.13 29.94,44.77 29.94,53.37 v30.62,54.04
  Bottom 0.254: v60.12,53.3 59.9,53.09 50.53,53.1 49.39,54.24 30.81,54.23 v30.62,54.04
ETH_TXD3  (via drill 0.3)  (1 unrouted)
  Top 0.254: v78.01,58.33 78.01,58.61 IC3.167 | 30.57,54.97 29.47,53.87 29.47,44.95 27.78,43.26 27.78,39.44 RN4.4
  Bottom 0.254: v78.01,58.33 77.99,58.36 68.58,58.36 67.46,57.24 60.85,57.24 60.73,57.37 60.72,57.37 60.65,57.43 51.86,57.43 49.7,55.27 30.86,55.27 v30.57,54.98
FMC_A0
  Top 0.254: IC6.23 43.99,54.89 41.97,56.91 41.97,59.6 45.48,63.11 64.14,63.11 65.48,61.77 65.48,59.94 IC3.16
FMC_A1
  Top 0.254: IC3.17 65,59.72 65,61.61 63.95,62.65 45.7,62.65 42.47,59.41 42.47,57.1 43.88,55.69 IC6.24
FMC_A2
  Top 0.254: IC3.18 64.51,59.49 64.51,61.44 63.76,62.19 45.93,62.19 42.96,59.22 42.96,57.29 43.76,56.49 IC6.25
FMC_A3
  Top 0.254: IC3.19 64.03,59.27 64.03,61.28 63.57,61.73 46.16,61.73 43.44,59.02 43.44,57.68 43.84,57.29 IC6.26
FMC_A4  (via drill 0.3)
  Top 0.254: IC3.20 64.08,58.51 v63.71,58.51 | IC6.29 38.64,57.29 v38.66,57.28
  Bottom 0.254: v63.71,58.51 63.56,58.66 62.63,58.66 62.42,58.45 51.51,58.45 50.02,56.96 39.75,56.96 39.43,57.28 v38.66,57.28
FMC_A5  (via drill 0.3)
  Top 0.254: IC3.21 64.09,57.8 63.08,57.8 v62.92,57.95 | IC6.30 39.21,56.49 v39.23,56.48
  Bottom 0.254: v62.92,57.95 51.7,57.95 50.23,56.48 v39.23,56.48
FMC_A6
  Top 0.254: IC6.31 36.12,55.69 42.53,49.28 42.53,37.81 43.66,36.68 44.48,36.68 45.77,36.68 57.98,36.68 59.28,37.97 61.62,37.97 IC3.60
FMC_A7
  Top 0.254: IC3.63 62.92,37.16 62.92,36.46 62.66,36.2 43.46,36.2 42.03,37.62 42.03,49.09 36.23,54.89 IC6.32
FMC_A8
  Top 0.254: IC3.64 63.42,36.95 63.42,36.28 62.85,35.71 43.25,35.71 43.2,35.76 43.1,35.87 41.55,37.41 41.55,48.87 36.34,54.08 33.61,54.08 IC6.33
FMC_A9
  Top 0.254: IC3.65 63.91,36.73 63.91,36.09 63.05,35.23 43.05,35.23 43,35.28 42.67,35.61 41.07,37.21 41.07,48.65 36.43,53.29 IC6.34
FMC_A10  (via drill 0.3)
  Top 0.254: IC3.66 64.4,36.51 64.4,35.89 63.26,34.75 42.83,34.75 40.56,37.02 40.56,48.13 v40.17,48.53 | v43.37,51.65 43.37,53.48 43.98,54.09 IC6.22
  Bottom 0.254: v40.17,48.53 40.5,48.53 43.37,51.4 v43.37,51.65
FMC_A11
  Top 0.254: IC3.67 64.88,36.29 64.88,35.69 63.46,34.27 42.62,34.27 42.58,34.3 42.01,34.87 40.08,36.8 40.08,47.61 39.45,48.23 39.45,49.58 36.55,52.49 IC6.35
FMC_BA0  (via drill 0.3)
  Top 0.254: IC6.20 45.6,52.49 48.04,54.93 v51.28,54.93 | IC3.112 79.33,42.55 79.33,45.97 v78.88,46.43
  Bottom 0.254: v51.28,54.93 54.39,54.93 55.75,53.57 59.38,53.57 59.83,54.01 62.05,54.01 65.53,50.53 75.1,50.53 78.88,46.76 v78.88,46.43
FMC_BA1  (via drill 0.3)
  Top 0.254: IC6.21 44.67,53.35 45.75,53.35 48.04,55.64 v53.3,55.64 | IC3.113 79.79,42.8 v79.79,46.49
  Bottom 0.254: v53.3,55.64 54.37,55.64 55.95,54.05 59.18,54.05 59.62,54.5 62.23,54.5 62.76,53.96 62.76,53.95 65.69,51.02 75.27,51.02 v79.79,46.49
FMC_D0  (via drill 0.3)
  Top 0.254: IC6.2 v43.52,38.09 | IC3.97 77.89,33.39 77.89,37.62 v77.56,37.95
  Bottom 0.254: v43.52,38.09 50.55,38.09 51.42,38.95 63.83,38.95 64.32,38.46 70.89,38.46 71.4,37.95 v77.56,37.95
FMC_D1  (via drill 0.3)
  Top 0.254: IC6.4 49.32,39.69 v49.73,39.28 | IC3.98 78.34,33.64 78.34,38.14 77.62,38.86 v77.56,38.86
  Bottom 0.254: v77.56,38.86 77.44,38.86 77,38.42 71.59,38.42 71.06,38.94 64.53,38.94 64.03,39.43 49.88,39.43 v49.73,39.28
FMC_D2  (via drill 0.3)
  Top 0.152: v81.19,44.11
  Top 0.254: IC6.5 45.73,40.49 v45.73,40.45 | v81.19,44.11 IC3.142
  Bottom 0.254: v45.73,40.45 46.58,40.45 46.77,40.64 51.34,40.64 52.26,41.55 55.95,41.55 56.71,40.79 65.47,40.79 66.38,41.71 78.79,41.71 v81.19,44.11
FMC_D3  (via drill 0.3)
  Top 0.254: IC6.7 45.46,42.09 v46.34,41.21 | IC3.143 81.39,45.02 v81.12,45.02
  Bottom 0.254: v46.34,41.21 46.43,41.12 51.14,41.12 52.05,42.04 56.16,42.04 56.92,41.27 65.3,41.27 66.2,42.18 78.6,42.18 80.5,44.08 80.5,44.4 v81.12,45.02
FMC_D4  (via drill 0.3)
  Top 0.254: IC6.8 45.36,42.89 46.34,41.91 47.04,41.91 v47.1,41.85 | IC3.68 66.57,37.27 66.57,43.04 65.87,43.74 v65.87,43.87
  Bottom 0.254: v47.1,41.85 49.34,41.85 51.09,43.6 65.6,43.6 v65.87,43.87
FMC_D5  (via drill 0.3)
  Top 0.254: IC6.10 45.74,44.49 46.15,44.9 v46.53,44.9 | IC3.69 67.05,37.04 67.05,43.26 66.58,43.73 66.58,44.49 v66.34,44.73
  Bottom 0.254: v66.34,44.73 65.6,44.73 64.96,44.08 50.88,44.08 49.77,42.96 48.46,42.96 v46.53,44.9
FMC_D6  (via drill 0.3)
  Top 0.254: IC6.11 45.78,45.29 46.15,45.66 47.24,45.66 v47.29,45.61 | IC3.70 67.55,36.83 67.55,43.46 67.06,43.94 67.06,45.31 v66.84,45.54
  Bottom 0.254: v66.84,45.54 65.73,45.54 64.75,44.56 48.26,44.56 47.29,45.53 v47.29,45.61
FMC_D7  (via drill 0.3)
  Top 0.254: IC6.13 45.44,46.89 46,46.33 47.58,46.33 48.22,45.7 v48.22,45.62 | IC3.73 68.82,35.98 68.82,36.65 68.03,37.44 68.03,43.67 67.55,44.16 v67.55,46.3
  Bottom 0.254: v67.55,46.3 65.8,46.3 64.54,45.05 48.79,45.05 v48.22,45.62
FMC_D8
  Top 0.254: IC6.42 37.18,46.89 39.59,44.48 39.59,36.6 42.41,33.78 61.59,33.78 62.94,32.44 64.16,32.44 65.87,34.15 67.69,34.15 IC3.74
FMC_D9
  Top 0.254: IC6.44 36.73,45.29 39.11,42.9 39.11,36.39 42.2,33.3 61.39,33.3 62.73,31.95 64.36,31.95 66.07,33.67 67.92,33.67 IC3.75
FMC_D10
  Top 0.254: IC6.45 36.45,44.49 38.63,42.3 38.63,36.2 42.01,32.82 61.19,32.82 62.53,31.47 64.56,31.47 66.28,33.19 68.14,33.19 IC3.76
FMC_D11
  Top 0.254: IC6.47 36.62,42.89 38.15,41.36 38.15,35.99 41.8,32.33 60.98,32.33 62.33,30.99 64.77,30.99 66.48,32.7 68.37,32.7 IC3.77
FMC_D12
  Top 0.254: IC6.48 36.23,42.09 37.66,40.65 37.66,35.79 41.6,31.85 60.77,31.85 62.12,30.49 64.96,30.49 66.68,32.22 68.59,32.22 IC3.78
FMC_D13
  Top 0.254: IC6.50 35.47,40.49 37.18,38.77 37.18,35.59 39.52,33.25 39.52,31.89 40.6,30.81 60.42,30.81 61.72,29.52 63.6,29.52 65.91,27.2 74.65,27.2 76.45,29.01 76.45,29.17 IC3.89
FMC_D14
  Top 0.254: IC6.51 35.57,39.69 36.7,38.56 36.7,35.37 39.02,33.05 39.02,31.69 40.38,30.33 60.22,30.33 61.52,29.03 63.4,29.03 65.71,26.72 74.84,26.72 77.06,28.94 77.06,29.27 IC3.90
FMC_D15
  Top 0.254: IC6.53 35.09,38.09 36.22,36.96 36.22,35.15 38.54,32.83 38.54,31.47 40.18,29.83 60.03,29.83 61.31,28.55 63.19,28.55 65.5,26.24 75.04,26.24 77.56,28.75 77.56,29.48 IC3.91
FMC_NBL0  (via drill 0.3, 0.3 pad 0.3)
  Top 0.254: IC3.169 77.68,59.69 76.86,59.69 v76.39,59.22 | IC6.15 43.73,48.49 43.58,48.64 43.58,49.71 40.92,52.38 40.92,59.54 v40.75,59.7
  Bottom 0.254: v76.39,59.22 76.27,59.22 75.57,59.92 40.97,59.92 v40.75,59.7
FMC_NBL1  (via drill 0.3)
  Top 0.254: IC3.170 77.45,60.17 v76.32,60.17 | IC6.39 32.51,49.29 32.28,49.52 v32.28,56.41
  Bottom 0.254: v32.28,56.41 35.76,56.41 39.77,60.43 76.07,60.43 v76.32,60.17
FMC_SDCKE0  (via drill 0.3)
  Top 0.254: IC3.43 57.31,49.02 54.05,49.02 v53.77,48.74 | IC6.37 35.75,50.89 v38.67,47.97
  Bottom 0.254: v38.67,47.97 38.81,47.83 40.48,47.83 42.21,49.55 52.95,49.55 v53.77,48.74
FMC_SDCLK  (via drill 0.3)
  Top 0.203: IC6.38 34.7,50.09 v34.72,50.1
  Top 0.254: IC3.116 84.44,40.27 v83.35,40.27
  Power 0.254: v34.72,50.1 41.09,43.73 47.13,43.73 50.71,40.15 v53.67,40.15
  Bottom 0.203: v53.67,40.15 53.79,39.99 56.12,39.99 56.46,40.34 77.52,40.34 77.85,40.01 83.11,40.01 83.35,40.25 v83.35,40.27
FMC_SDNCAS  (via drill 0.3)
  Top 0.254: IC6.17 43.9,50.09 41.44,52.55 41.44,60.44 v42.12,61.12 | IC3.160 81.58,57.25 v80.73,56.4
  Bottom 0.254: v80.73,56.4 80.73,57.54 77.36,60.91 42.34,60.91 v42.12,61.12
FMC_SDNE0  (via drill 0.3)
  Top 0.254: IC6.19 46.01,51.69 v46.4,51.3 | IC3.44 57.36,48.26 54.72,48.26 v54.67,48.31
  Bottom 0.254: v46.4,51.3 47.67,50.02 53.46,50.02 54.67,48.82 v54.67,48.31
FMC_SDNRAS  (via drill 0.3)
  Top 0.254: IC6.18 45.62,50.89 45.93,50.57 49.37,50.57 50.21,49.73 50.21,47.5 51.27,46.44 v51.27,46.27 | IC3.59 64,41.07 64,42.74 63.06,43.67 v63.06,46.2
  Bottom 0.254: v51.27,46.27 51.56,45.97 62.84,45.97 v63.06,46.2
FMC_SDNWE
  Top 0.254: IC3.46 59.05,45.31 59.05,45.52 58.66,45.91 51.89,45.91 51.56,45.58 50.92,45.58 50.54,45.96 50.54,46.48 49.73,47.3 49.73,49.53 49.18,50.08 46.24,50.08 45.45,49.29 IC6.16
FRM2
  cutout Gnd: 137.27,63.02 134.99,63.02 134.99,68.36 137.27,68.36
  cutout Top: 137.27,63.02 134.99,63.02 134.99,68.36 137.27,68.36
FRM3
  cutout Power: 137.27,63.02 134.99,63.02 134.99,68.36 137.27,68.36
GND  (via drill 0.3, 0.4)
  Top 0.152: v94.29,15.35 95.06,15.35 C49.- | v94.1,12.05 IC8.2 | v113.52,16 C7.2 | C6.1 v104.99,16.02 | v107.62,19.81 C3.1 | v34.59,58.24 33.58,58.11 IC6.28 | v71.38,17.64 IC11.3 | v86.83,57.85 86.69,57.71 C30.2 | v100.69,46.38 100.49,46.58 C22.- | IC13.3 | v57.15,2.04 58.12,1.91 C39.2 | v121.65,8.45 C4.1 | v76.39,21.23 JP7.NC | IC7.7 114.67,46.87 v114.59,46.88 | IC7.3 108.1,45.57 107.55,45.57 106.98,45 v106.98,44.31 108.1,44.3 | v88.59,59.6 89.36,59.6 R18.1 | IC5.3 100.5,65.42 v100.48,65.39 | C23.2 86.72,34.86 v86.76,34.85 | C27.2 82.27,30.46 v82.28,30.44 | Q2.2 v100.72,37.2 | 24.41,40.78 24.64,40.78 v25.12,41.08 | IC7.2 107.03,46.87 v107.01,46.85 107.01,47.64 107.51,48.14 IC7.1 | C15.- 23.53,15.79 v23.53,16.55 | C1.2 11.37,61.68 v11.72,62.03
  Top 0.203: C63.2 v12.98,41.94 | C66.2 v10.96,37.48 | C65.2 v10.97,35.76 | 24.41,40.78 C60.2 | v18.78,39.97 18.89,40.72 C58.2 | IC14.19 16.05,35.81 | v22.63,32.79 v22.64,32.79 IC14.47 | 27.62,31.37 C68.2 | v26.89,19.52 25.95,19.52 R34.1 | IC3.117 85.25,40.17 v85.25,40.7 | R37.1 v20.09,18.47 | 108.1,44.3 IC7.4 | IC1.3 v37.22,11.47 | v35.92,14.4 C2.2 | v17.56,16.89 17.56,16.07 C14.2
  Top 0.229: v81.33,9.61 81.33,10.02 IC10.3 | v83.69,7.01 83.31,7.01 J2.5 | IC12.13 82.52,19.27 v82.27,19.02
  Top 0.254: v43.42,41.27 44.59,41.27 IC6.6 | IC6.46 32.5,43.69 v32.43,43.62 | IC6.54 33.58,37.27 32.45,37.27 v32.45,37.27 | v32.43,38.86 33.57,38.86 IC6.52 | IC6.12 44.55,46.04 v43.37,46.04 | LCD1.29 66.43,14.44 v66.4,14.41 | C54.1 v74.61,21.35 | IC3.61 64.22,39.87 64.65,39.87 v64.87,39.65 | C20.2 v59.45,37.11 | v60.21,56.67 59.29,56.67 C9.1 | v53.44,56.67 54.4,56.67 C11.1 | v57.44,51.41 57.2,52.16 C18.2 | IC3.37 61.39,49.18 v61.39,49.15 | C67.2 v17.61,24.89 | IC14.35 17.85,28.61 18.69,29.45 v19.03,29.45 19.03,29.12 IC14.36 | v19.48,13.03 20.53,13.03 IC4.1 | C61.1 26.35,46.93 v27.17,47.45 | v19.85,24.87 19.03,24.87 C62.2 | 16.05,35.81 16.79,35.08 v16.79,34.29 | v62.01,55.23 62.01,55.93 C17.2 | v66.35,61.85 66.9,61.86 C16.2 | v87.55,35.53 C24.2 | C28.2 v95.3,44.2 | v95.87,42.33 C36.2 | v94.95,49.24 C29.2 | LCD1.3 53.43,14.56 v53.64,14.35 | IC6.41 v34.84,47.69 | C56.1 v83.45,24.56 | C55.1 v82.85,22.72 | v54.52,40.66 54.61,41.39 R12.1 | v66.78,54.76 66.41,54.76 IC3.22 | v68.11,36.36 67.78,36.36 IC3.71 | v55.8,40.69 56.51,40.69 C19.2 | IC3.14 69.11,57.73 69.11,57.23 v68.93,57.05 | IC3.103 v80.06,35.46 | v88.68,6.38 89.72,6.38 Q1.E | IC3.148 84.83,51.99 84.45,51.99 v83.25,50.79 | v89.78,45.31 89.78,44.83 IC3.130 | v63.52,33.12 C21.2 | v54.49,20.45 53.42,20.13 C50.2 | C48.2 51.02,20.75 v50.68,21.09 | v52.89,22.31 R25.2 | IC3.158 81.49,55.73 v81.49,55.69 | IC13.3 v21.55,47.92 | v112.31,49.1 112.31,49.92 C40.1 | IC12.6 79.43,17.97 v79.54,17.93 | v86.71,11.19 85.87,11.19 C52.1 | v53.96,8.45 JP6.NC | v105.28,65.65 C38.2 | IC12.14 82.63,19.92 82.27,19.56 v82.27,19.02 | C35.2 52.84,50.59 v52.65,50.77 | C34.2 48.7,52.09 v48.69,52.08 | IC3.109 82.29,37.48 v82.06,37.48
  Top 0.254: IC3.95 78.95,30.91 v79.12,30.91 | IC3.135 89.58,47.55 v89.57,47.54 | 27.62,31.37 v28.47,31.37 v28.48,31.38 | IC14.15 16.43,38.29 v16.43,38.62
  Top 0.305: v66.2,27.91 66.2,28.55 C37.2 | v68.31,27.93 68.31,28.35 C26.2 | v35.99,16.62 C5.2 | v41.75,18.21 IC2.8 | C64.- 11.92,30.99 v12.26,31.33 | C51.2 v77.71,13.8 | C57.2 v17.22,44.73 | C59.1 15.27,47.5 v15.25,47.47
  Top 0.356: IC9.2 48.51,24.12
  Top 0.406: C41.2 v48.24,37.38 | v49.25,43.67 C42.2 | v48.22,48.68 C43.2 | C44.2 v49.07,58.1 | C45.2 v31.24,48.74 | v31.25,44.26 C46.2 | C32.2 89.94,53.81 89.9,53.85 v89.89,54.59 89.9,55.15 C33.2 | 48.51,24.12 v48.48,24.14 | v44.33,27.5 44.33,26.76 C47.2 | v71.27,64.34 C12.2 C10.2 72.81,66.95 C25.2 | v78.09,64.22 78.78,64.22 C31.2 80.46,64.36 R13.1 | C53.1 108.88,29.92 v109.2,30.24 | C13.2 v12.06,19.02 | v7.21,32.68 8.16,33.02 D1.A | R47.1 v8.44,27.93
  Top 0.61: v10.8,52.84 v10.8,53.53 10.8,54.15 JP1.1
  Bottom 0.254: J1.6 v64.95,2.95 v64.96,2.96 | 55.7,2.16 55.7,3.89 v55.57,3.89
  other vias: 94.29,14.59 43.53,27.5 90.57,54.58 100.69,47.08 63.13,13.63 7.21,32 12.06,18.34 19.48,13.73 19.48,12.33 22.84,16.55 11.59,31.33 57.15,2.69 50.36,41.85 72.89,41.02 72.91,42.86 72.91,39.32 86.72,44.55 51.37,21.09 83.69,7.7 111.95,54.15 106.8,54.41 11.72,61.34 108.5,30.24 116.87,29.53 121.73,31.32 12.06,19.72 70.58,2.57 70.6,12.57 7.21,33.36
  pour Gnd (isolate 0.203, rank 2): 0.05,69.85 139.81,69.85 139.81,0.25 48.69,-0.13 48.69,11.18 40.15,11.2 40.15,7.39 37.38,7.39 37.38,11.18 28.62,11.18 28.62,-0.13 0.05,-0.13
  pour Bottom (isolate 0.203, rank 2): 0.44,70.36 139.62,70.36 139.62,-0.25 48.69,-0.25 48.69,11.18 40.18,11.18 40.18,7.37 37.38,7.37 37.38,11.18 28.62,11.18 28.62,-0.25 0.44,-0.25
HOLE_MCU1  (via drill 3.2 pad 5.5)
  other vias: 3.5,66.5
HOLE_MCU2  (via drill 3.2 pad 5.5)
  other vias: 122.5,66.5
HOLE_MCU3  (via drill 3.2 pad 5.5)
  other vias: 3.5,3.5
HOLE_MCU4  (via drill 3.2 pad 5.5)
  other vias: 122.5,3.5
I2C1_SCL  (via drill 0.3)
  Top 0.152: 85.03,61.77 R15.2 85.56,61.26 85.56,60.92 v85.66,60.82 84.29,60.82 83.56,60.1 81.62,60.1 IC3.164 | v109.06,59.51 115.74,52.83 115.74,45.61 | IC7.6 115.74,45.6 115.74,45.61 | IC12.12 86.56,18.62 v86.58,18.64 | 115.74,45.61 115.74,43.09 116.32,42.52 116.32,32.32 v116.7,31.94 | v85.66,65.3 85.66,66.5 SCL.1
  Power 0.152: v95.53,18.78 86.72,18.78 v86.58,18.64
  Bottom 0.152: v109.06,59.51 108.8,59.78 90.45,59.78 89.4,60.82 v85.66,60.82 v85.66,65.3 | v95.53,18.78 95.23,19.07 95.23,26.95 97.52,29.23 112.62,29.23 115.33,31.94 v116.7,31.94 | v116.7,31.94 | X1.12 127.46,31.98 116.73,31.98 v116.7,31.94
I2C1_SDA  (via drill 0.3)
  Top 0.152: 116.12,44.31 116.12,53.02 110.04,59.11 v110.04,59.44 | v116.54,44.31 116.12,44.31 | v115.1,44.31 113.49,44.31 IC7.5 | v116.98,34.54 116.7,34.76 116.7,42.67 116.12,43.24 116.12,44.31 | 83.02,61.57 R16.2 83.33,61.51 83.33,60.77 | IC12.11 v85.93,17.97 85.91,17.97 | IC3.165 81.59,60.77 83.33,60.77 | 83.33,60.77 v83.36,60.8 | v84.72,65.82 84.72,66.2 84.06,66.86 81.94,66.86 SDA.2
  Power 0.152: v94.85,18.15 94.85,18.16 94.59,18.43 87.27,18.43 86.81,17.97 v85.93,17.97
  Bottom 0.152: v115.1,44.31 v116.54,44.31 | X1.14 117.04,34.48 v116.98,34.54 115.95,33.52 115.95,33.08 112.45,29.59 97.37,29.59 94.88,27.1 94.88,17.92 v94.85,18.15 | v110.04,59.44 109.48,58.88 108.78,58.88 108.26,59.4 90.28,59.4 89.24,60.44 86.18,60.44 85.91,60.17 85.3,60.17 84.72,60.76 | v84.72,65.82 84.72,60.76 | 84.72,60.76 83.4,60.76 v83.36,60.8
IRQ_TOUCH  (via drill 0.3)
  Top 0.152: IC3.151 81.07,50.36 v81.07,50.32 | IC12.10 82,17.32 v81.89,17.44
  Bottom 0.152: v81.07,50.32 81.07,49.59 84.48,46.19 84.48,44.54 87.54,41.48 87.54,39.5 89.15,37.88 89.15,24.37 82.22,17.44 v81.89,17.44
LCD_DISP
  Top 0.152: LCD1.31 67.43,16.58 67.43,22.73 R30.1
LED_ACT  (via drill 0.3)
  Top 0.203: IC14.26 13.7,30.86 13.7,28.46 11.93,26.7 10.03,26.7 9.17,25.83 v9.17,25.81 9.17,24.55 R35.2 | R43.2 31.41,66.36 25.68,66.36 21.1,61.78 21.1,60.96 10.49,50.34 v9.9,50.34
  Power 0.203: v9.9,50.34 9.9,50.14 9.2,49.44 9.2,25.84 v9.17,25.81
LED_LINK  (via drill 0.3)
  Top 0.203: IC14.28 14.51,30.25 14.51,27.67 12.96,26.12 12.96,25.49 | R42.2 12.96,25.49 | v12.7,25.46 12.94,25.46 12.96,25.49 | R44.2 29.86,65.95 25.85,65.95 21.51,61.61 21.51,60.78 v9.88,49.15
  Power 0.203: v12.7,25.46 12.56,25.32 10.7,25.32 9.62,26.4 9.62,48.45 9.88,48.7 v9.88,49.15
LED_SPEED  (via drill 0.3)
  Top 0.203: IC14.27 14.11,30.55 14.11,27.85 12.28,26.02 v11.82,26.02 10.99,25.2 R40.2 | SPEED.C 33.11,66.78 25.51,66.78 20.7,61.96 20.7,61.14 11.01,51.45 v9.95,51.45
  Power 0.203: v11.82,26.02 10.59,26.02 10.03,26.58 10.03,48.27 10.57,48.82 10.57,50.83 v9.95,51.45
LTDC_B3  (via drill 0.3)
  Top 0.152: IC3.154 75.12,46.52 75.12,32.83 v75.69,32.26 | 63.17,20.18 v63,20.34 63.92,19.42 LCD1.24
  Bottom 0.152: v75.69,32.26 75.69,31.89 76.63,30.95 76.63,27.3 75.14,25.82 74.32,25.82 71.57,23.08 68.79,23.08 66.06,20.34 v63,20.34
LTDC_B4  (via drill 0.3)
  Top 0.152: IC3.155 74.76,46.87 74.76,31.89 v75.29,31.36 | 63.67,21 v63.5,21.17 64.42,20.24 LCD1.25
  Bottom 0.152: v63.5,21.17 63.53,21.13 66.34,21.13 68.64,23.43 71.42,23.43 74.16,26.18 74.99,26.18 76.27,27.46 76.27,30.38 v75.29,31.36
LTDC_B5  (via drill 0.3)
  Top 0.152: v74.98,30.44 74.41,31.01 74.41,47.04 75.92,48.55 75.92,55.7 74.8,56.82 74.8,60.35 IC3.174 | 64.17,21.81 v63.98,22 64.92,21.05 LCD1.26
  Bottom 0.152: v74.98,30.44 75.92,29.5 75.92,27.61 74.84,26.53 74.01,26.53 71.27,23.79 68.49,23.79 66.57,21.87 64.11,21.87 v63.98,22
LTDC_B6  (via drill 0.3)
  Top 0.152: IC3.175 74.43,60.69 74.43,56.67 75.56,55.54 75.56,48.72 74.59,47.75 74.28,47.43 74.05,47.21 74.05,30.86 74.29,30.62 74.29,30.21 v74.98,29.53 | 64.67,22.61 v64.41,22.87 65.42,21.86 LCD1.27